# EAGLE design omc-complete (EAGLE 5.10)
GROUP: openmulticopter.org (c) 2009; LICENSE: CC-BY-SA 3.0 DE; PROJECT_NAME: openmulticopter - mini; REV: v0.1

## Sheet 1 of 6
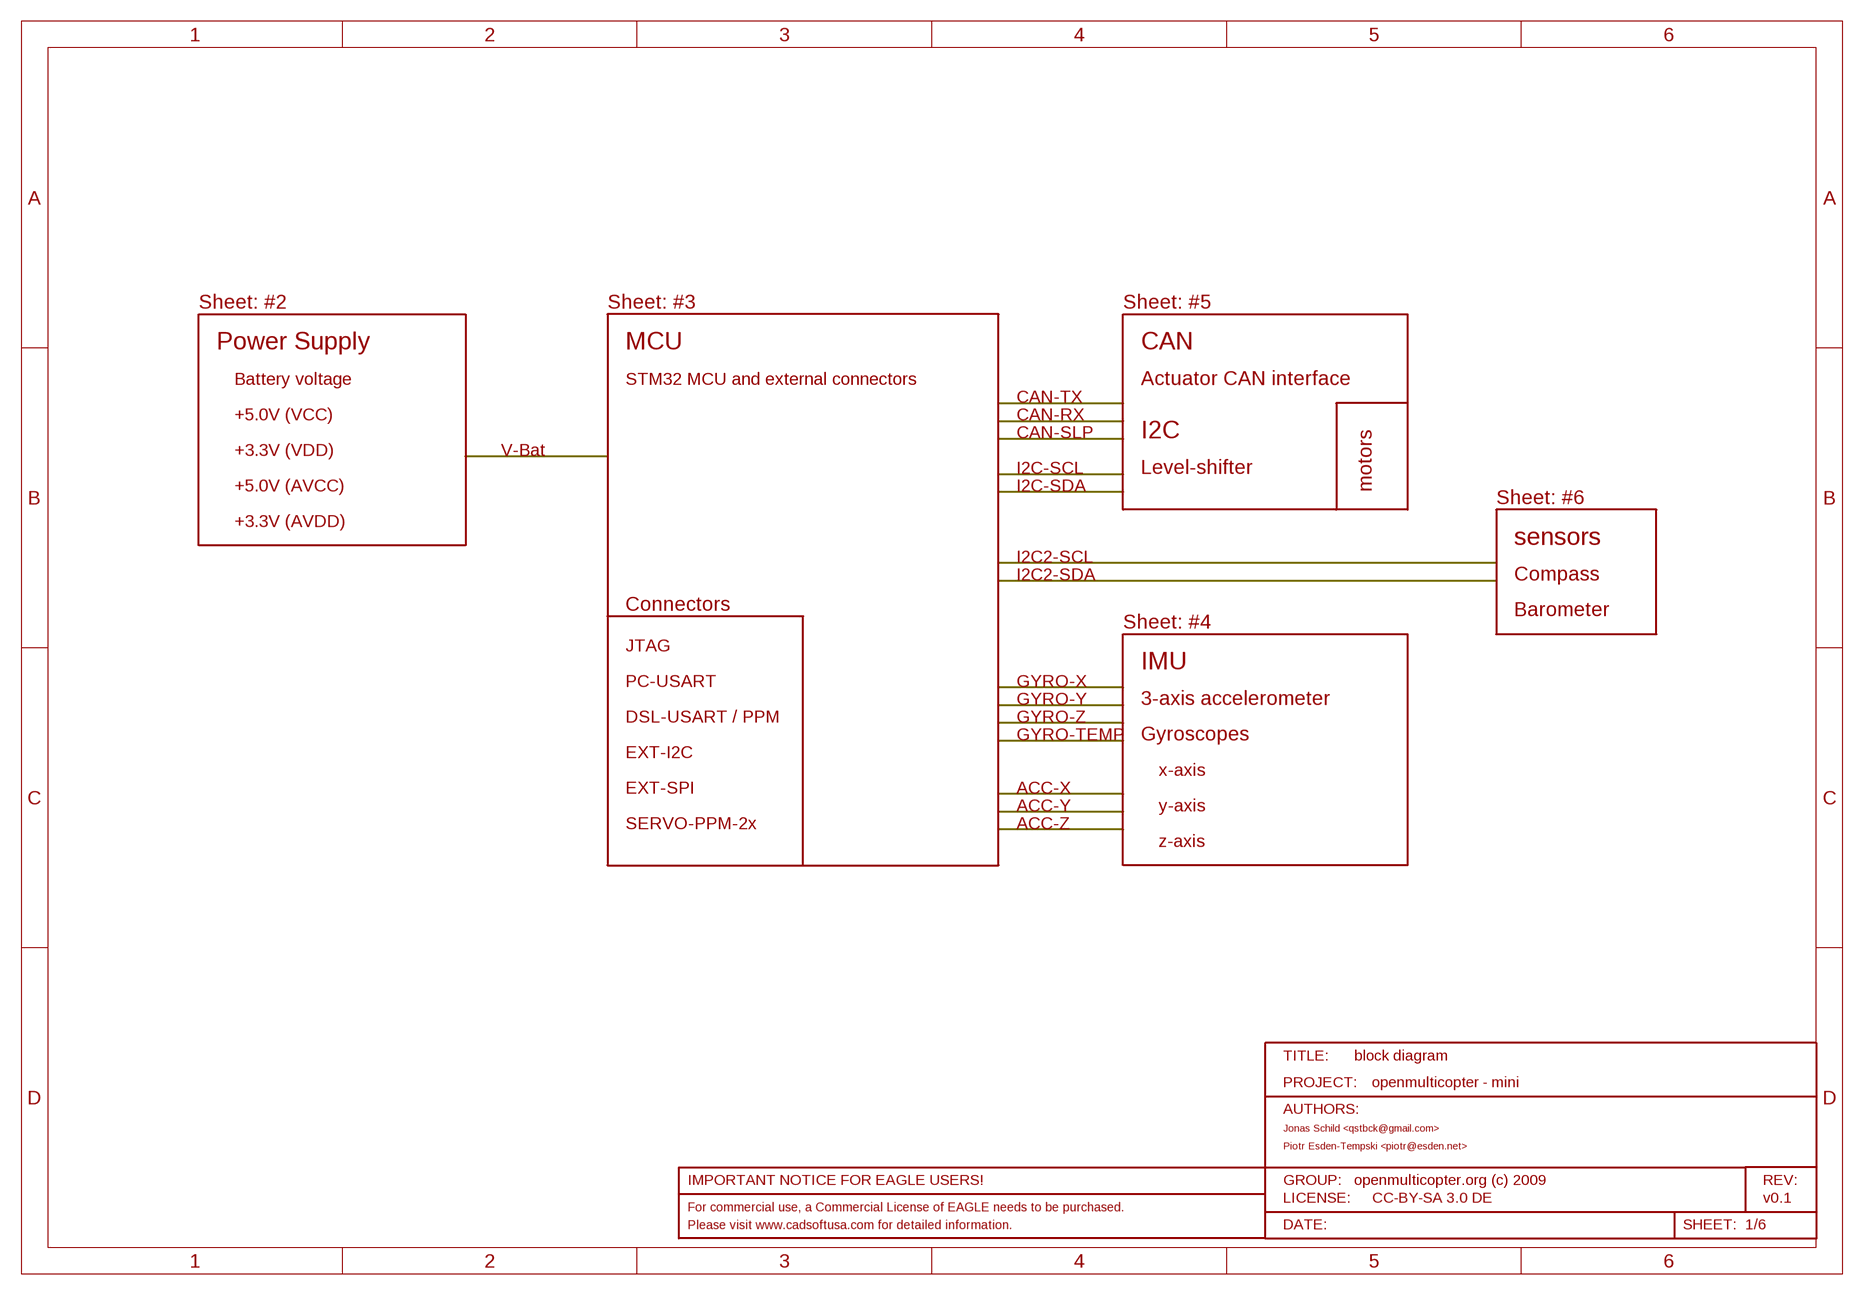
[diagram p0: schematic, sheet 1]

### Notes on the sheet
- Sheet: #2 | Sheet: #3 | Sheet: #5
- Power Supply | MCU | CAN
- Battery voltage | STM32 MCU and external connectors | Actuator CAN interface
- CAN-TX
- +5.0V (VCC) | CAN-RX
- CAN-SLP | I2C
- +3.3V (VDD) | V-Bat
- I2C-SCL | Level-shifter
- +5.0V (AVCC) | I2C-SDA | motors
- Sheet: #6
- +3.3V (AVDD)
- sensors
- I2C2-SCL
- I2C2-SDA | Compass
- Connectors | Barometer
- Sheet: #4
- JTAG
- IMU
- PC-USART | GYRO-X
- GYRO-Y | 3-axis accelerometer
- DSL-USART / PPM | GYRO-Z
- GYRO-TEMP | Gyroscopes
- EXT-I2C
- x-axis
- EXT-SPI | ACC-X
- ACC-Y | y-axis
- SERVO-PPM-2x | ACC-Z
- z-axis
- block diagram
- Jonas Schild <qstbck@gmail.com>
- Piotr Esden-Tempski <piotr@esden.net>

## Sheet 2 of 6
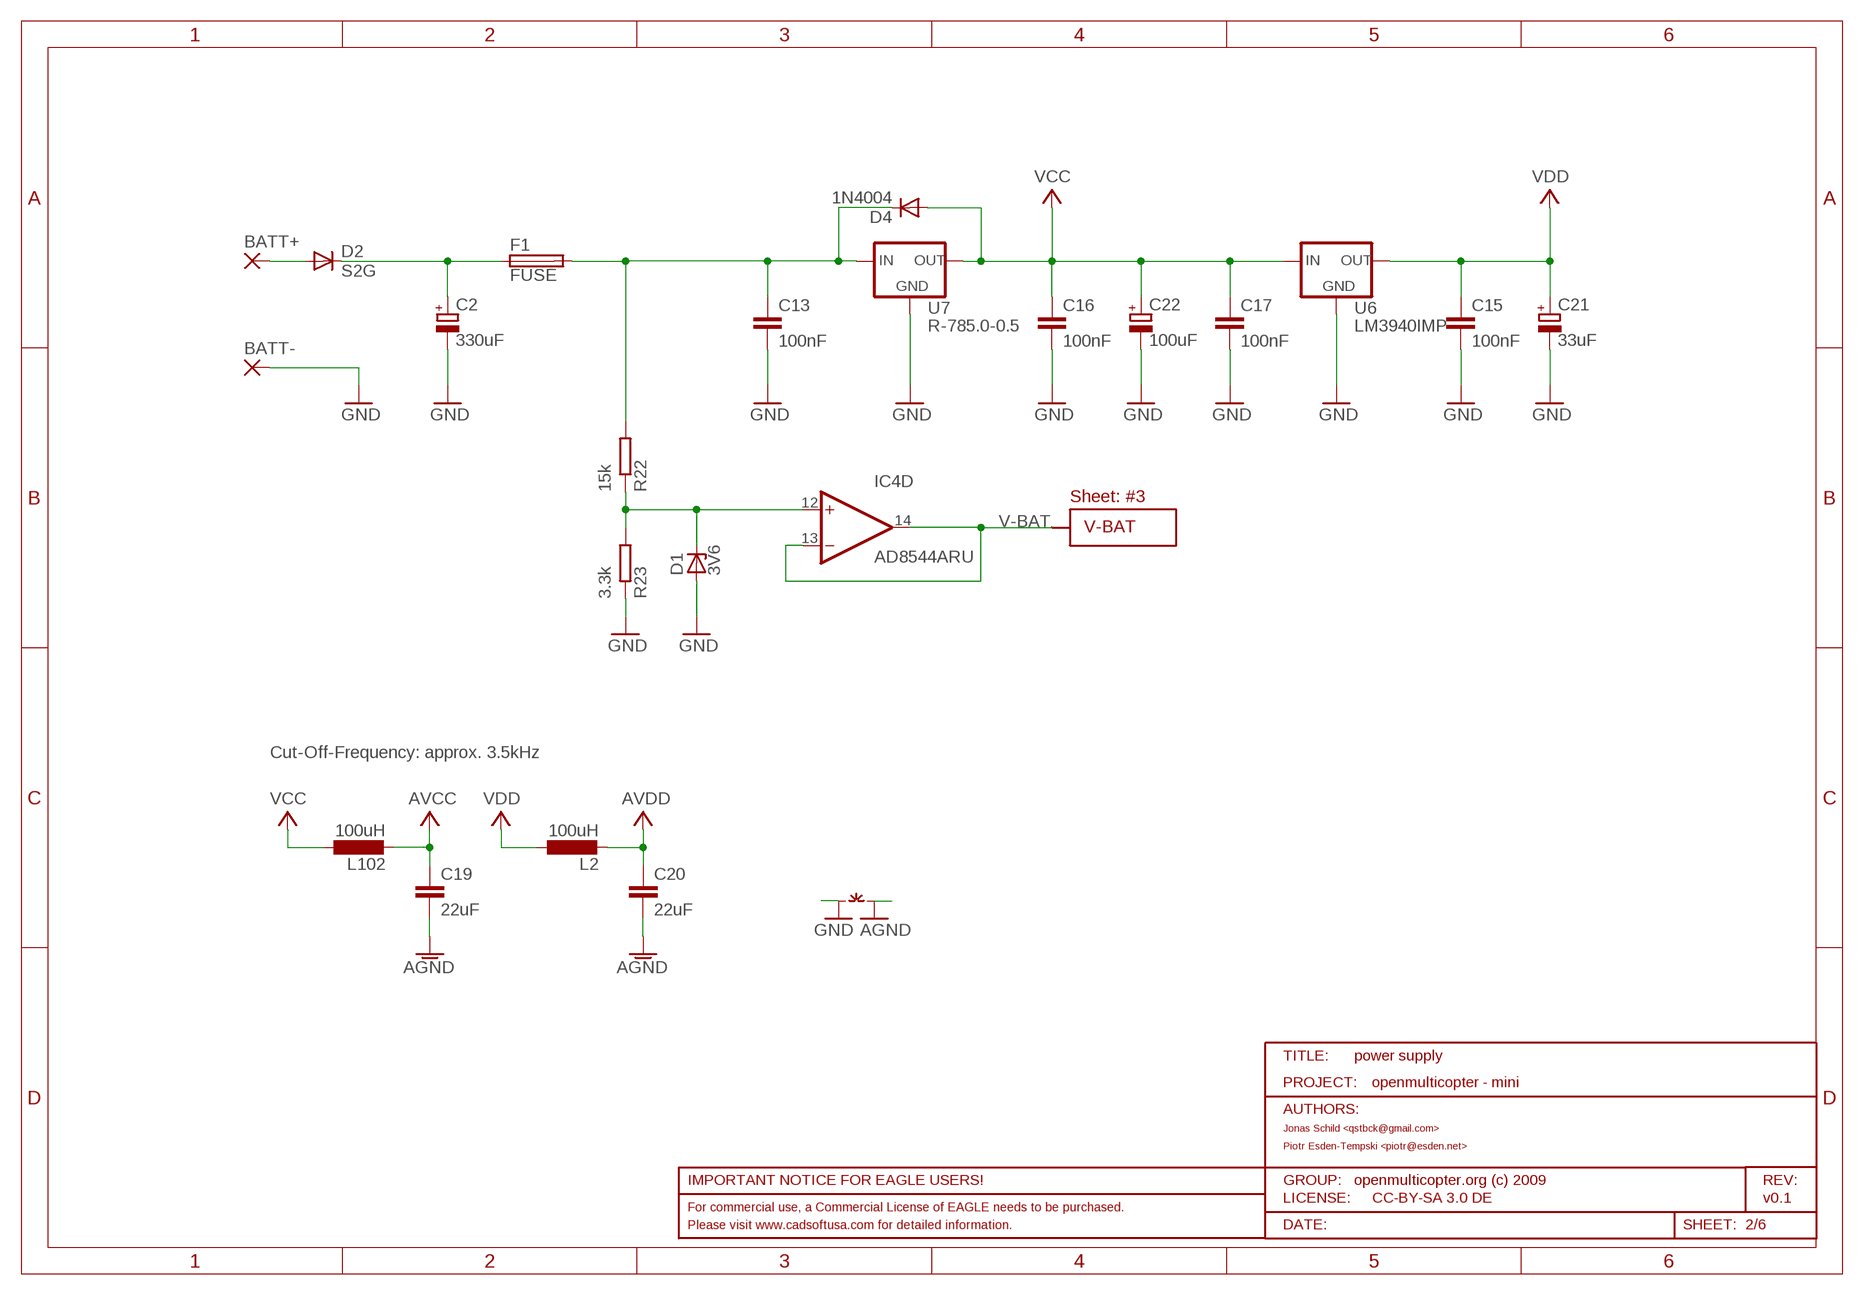
[diagram p1: schematic, sheet 2]

### Parts
BATT+  3,17/1,1  [3,17/1,1]
BATT-  3,17/1,1  [3,17/1,1]
C2  330uF  CPOL-EUE3.5-8  [E3,5-8]
C13  100nF  CAPACITOR-0603  [0603-CAP]
C15  100nF  CAPACITOR-0603  [0603-CAP]
C16  100nF  CAPACITOR-0603  [0603-CAP]
C17  100nF  CAPACITOR-0603  [0603-CAP]
C19  22uF  CAPACITOR-0805  [0805-CAP]
C20  22uF  CAPACITOR-0805  [0805-CAP]
C21  33uF  CAPACITOR-POLB  [3528/B]
C22  100uF  CPOL-EUE2-5  [E2-5]
D1  3V6  ZENER-DIODESOT23  [SOT23]
D2  S2G  DIODE-B  [3528/B-DIO]
D4  1N4004  DIODE-MELF  [MELF-MLL41]
F1  FUSE  FUSE-1206  [1206-FUSE]
IC4  AD8544ARU  [TSSOP14]
L2  100uH  INDUCTOR-0805  [0805-IND]
L102  100uH  INDUCTOR-1210  [1210-IND]
R22  15k  RESISTOR-0603  [0603-RES]
R23  3.3k  RESISTOR-0603  [0603-RES]
U6  LM3940IMP  [SOT223]
U7  R-785.0-0.5  R-78XX  [R-78XX]
U$2  GND-AGND  [GND-AGND]

### Nets
AGND: C19.P$2 C20.P$2 U$2.AGND ; also sheet 3,4
AVCC: C19.P$1 L102.P$2 ; also sheet 4
AVDD: C20.P$1 L2.P$2 ; also sheet 3,4
GND: BATT-.1(P) C2.- C13.P$2 C15.P$2 C16.P$2 C17.P$2 C21.- C22.- D1.1(A) R23.P$1 U6.2(GND) U7.GND U$2.GND ; also sheet 3,5,6
N$7: C13.P$1 D4.C F1.P$2 R22.P$2 U7.IN
N$8: BATT+.1(P) D2.A
N$21: C2.+ D2.C F1.P$1
N$30: D1.3(C) IC4.12(D:+IN) R22.P$1 R23.P$2
V-BAT: IC4.13(D:-IN) IC4.14(D:OUT) ; also sheet 3
VCC: C16.P$1 C17.P$1 C22.+ D4.A L102.P$1 U6.1(IN) U7.OUT ; also sheet 3,5
VDD: C15.P$1 C21.+ L2.P$1 U6.3(OUT) ; also sheet 3,5,6

### Notes on the sheet
- Sheet: #3
- V-BAT
- Cut-Off-Frequency: approx. 3.5kHz
- power supply
- Jonas Schild <qstbck@gmail.com>
- Piotr Esden-Tempski <piotr@esden.net>

## Sheet 3 of 6
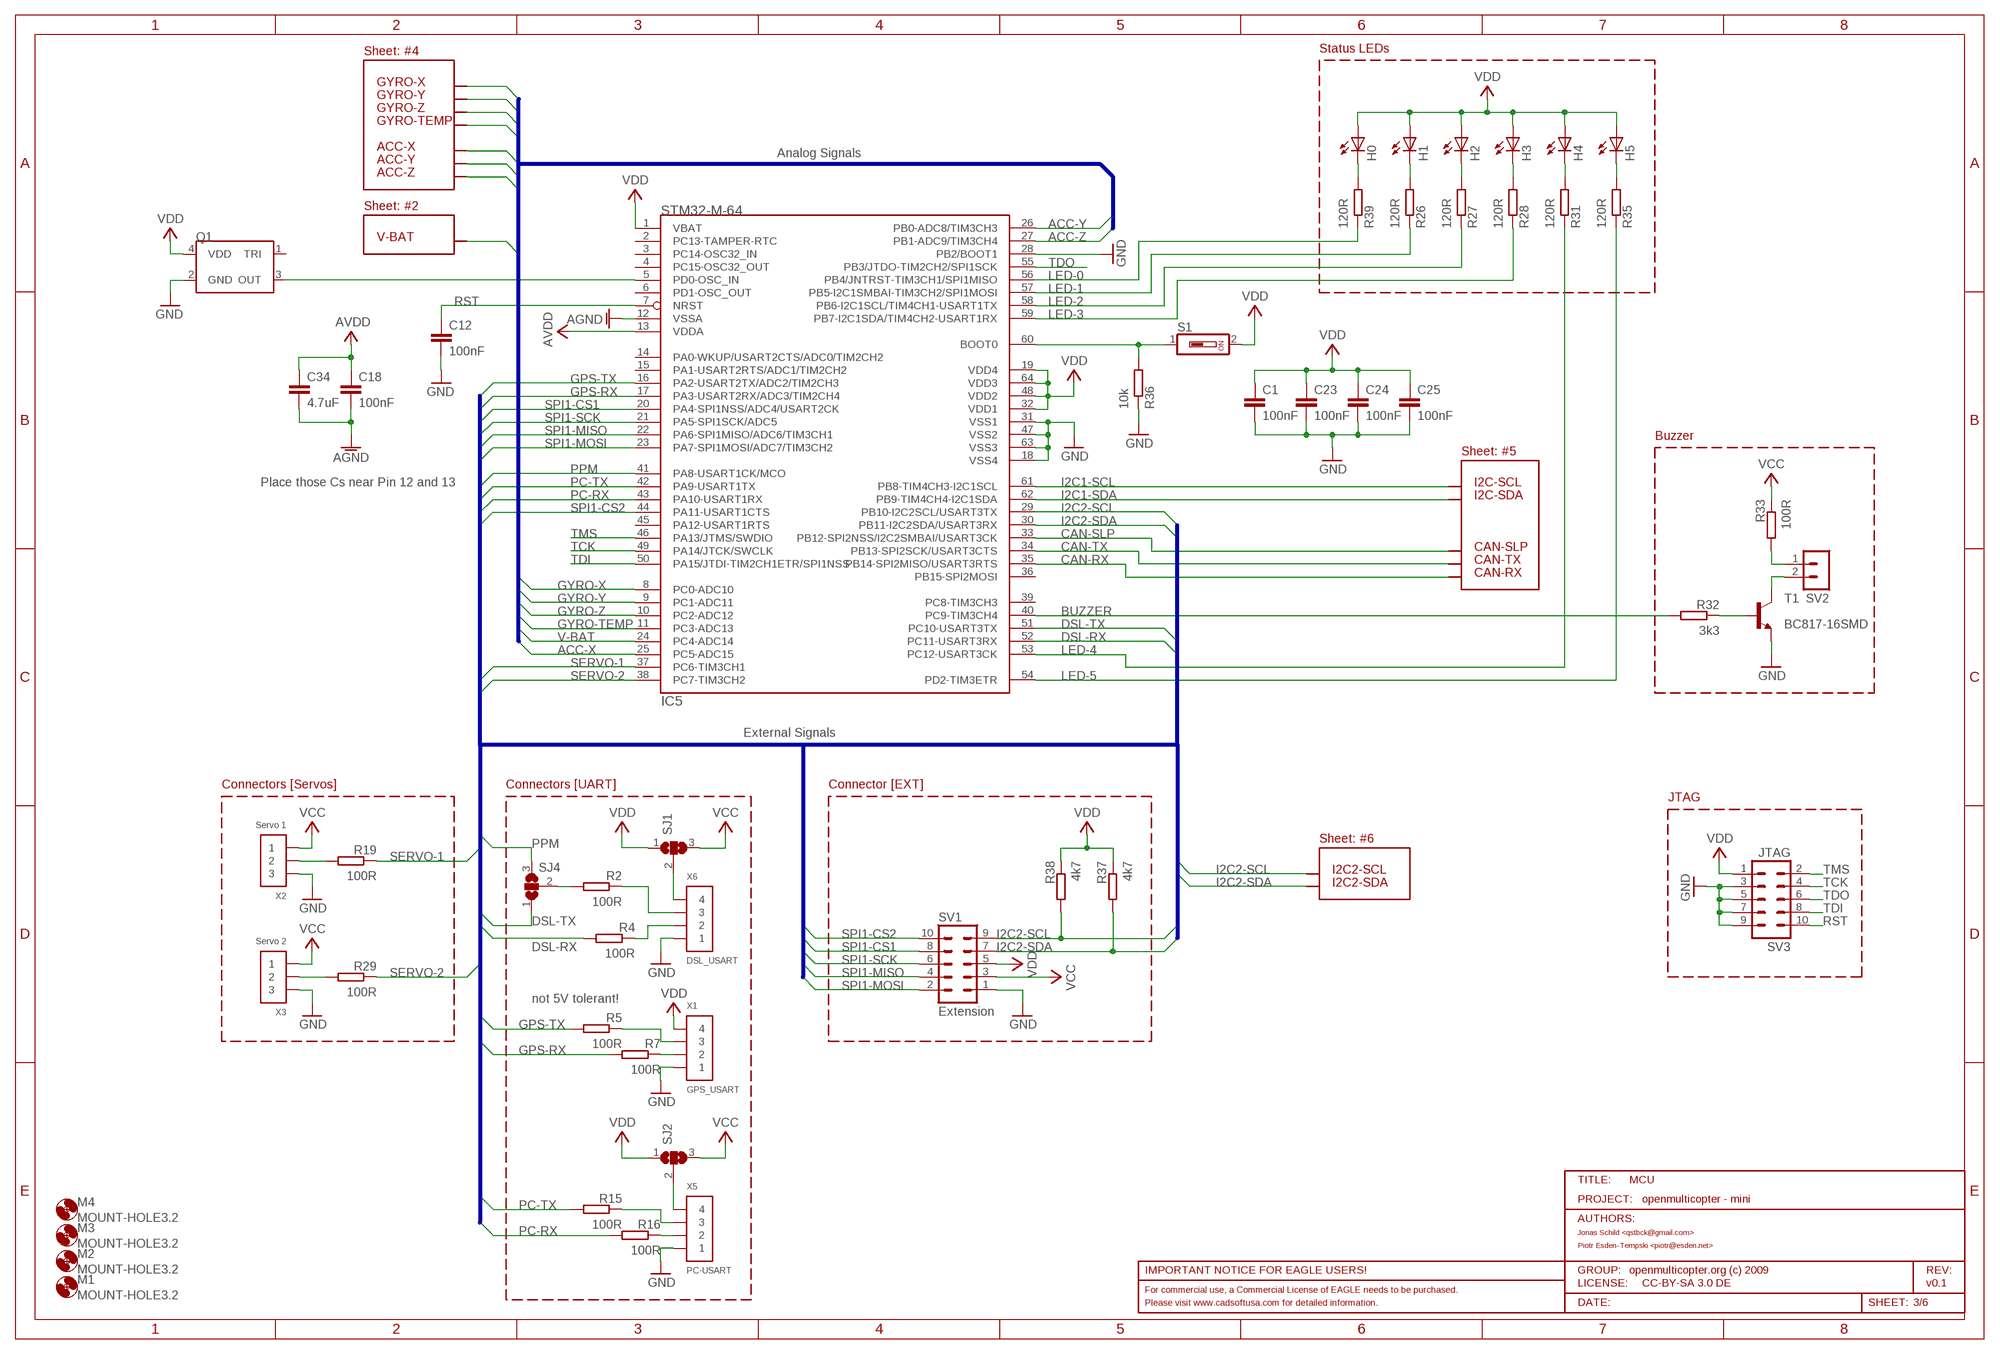
[diagram p2: schematic, sheet 3]

### Parts
C1  100nF  CAPACITOR-0603  [0603-CAP]
C12  100nF  CAPACITOR-0603  [0603-CAP]
C18  100nF  CAPACITOR-0603  [0603-CAP]
C23  100nF  CAPACITOR-0603  [0603-CAP]
C24  100nF  CAPACITOR-0603  [0603-CAP]
C25  100nF  CAPACITOR-0603  [0603-CAP]
C34  4.7uF  CAPACITOR-0603  [0603-CAP]
H0  LED-0603  [0603-LED]
H1  LED-0603  [0603-LED]
H2  LED-0603  [0603-LED]
H3  LED-0603  [0603-LED]
H4  LED-0603  [0603-LED]
H5  LED-0603  [0603-LED]
IC5  STM32-M-64  [LQFP64]
M1  MOUNT-HOLE3.2  [3,2]
M2  MOUNT-HOLE3.2  [3,2]
M3  MOUNT-HOLE3.2  [3,2]
M4  MOUNT-HOLE3.2  [3,2]
Q1  ASE_OSCILLATOR  [ASE_OSCILLATOR]
R2  100R  RESISTOR-0603  [0603-RES]
R4  100R  RESISTOR-0603  [0603-RES]
R5  100R  RESISTOR-0603  [0603-RES]
R7  100R  RESISTOR-0603  [0603-RES]
R15  100R  RESISTOR-0603  [0603-RES]
R16  100R  RESISTOR-0603  [0603-RES]
R19  100R  RESISTOR-0603  [0603-RES]
R26  120R  RESISTOR-0603  [0603-RES]
R27  120R  RESISTOR-0603  [0603-RES]
R28  120R  RESISTOR-0603  [0603-RES]
R29  100R  RESISTOR-0603  [0603-RES]
R31  120R  RESISTOR-0603  [0603-RES]
R32  3k3  RESISTOR-0603  [0603-RES]
R33  100R  RESISTOR-0603  [0603-RES]
R35  120R  RESISTOR-0603  [0603-RES]
R36  10k  RESISTOR-0603  [0603-RES]
R37  4k7  RESISTOR-0603  [0603-RES]
R38  4k7  RESISTOR-0603  [0603-RES]
R39  120R  RESISTOR-0603  [0603-RES]
S1  COPAL_CVS-01B  [COPAL_CVS-01B]
SJ1  SJ2S  [SJ2S]
SJ2  SJ2S  [SJ2S]
SJ4  SJ2S  [SJ2S]
SV1  Extension  ML10L  [ML10L]
SV2  MA02-1  [MA02-1]
SV3  JTAG  ML10  [SMD_HEADER_1.27MM_2X5]
T1  BC817-16SMD  [SOT23-BEC]
X1  GPS_USART  CONN_4-1-53261  [PB-53261-04]
X2  Servo 1  CONN_3-1-53047  [PB-53047-03]
X3  Servo 2  CONN_3-1-53047  [PB-53047-03]
X5  PC-USART  CONN_4-1-53261  [PB-53261-04]
X6  DSL_USART  CONN_4-1-53261  [PB-53261-04]

### Nets
ACC-X: IC5.25(PC5-ADC15) ; also sheet 4
ACC-Y: IC5.26(PB0-ADC8/TIM3CH3) ; also sheet 4
ACC-Z: IC5.27(PB1-ADC9/TIM3CH4) ; also sheet 4
AGND: C18.P$2 C34.P$2 IC5.12(VSSA) ; also sheet 2,4
AVDD: C18.P$1 C34.P$1 IC5.13(VDDA) ; also sheet 2,4
BUZZER: IC5.40(PC9-TIM3CH4) R32.P$2
CAN-RX: IC5.35(PB14-SPI2MISO/USART3RTS) ; also sheet 5
CAN-SLP: IC5.33(PB12-SPI2NSS/I2C2SMBAI/USART3CK) ; also sheet 5
CAN-TX: IC5.34(PB13-SPI2SCK/USART3CTS) ; also sheet 5
DSL-RX: IC5.52(PC11-USART3RX) R4.P$2
DSL-TX: IC5.51(PC10-USART3TX) SJ4.1
GND: C1.P$2 C12.P$2 C23.P$2 C24.P$2 C25.P$2 IC5.18(VSS4) IC5.28(PB2/BOOT1) IC5.31(VSS1) IC5.47(VSS2) IC5.63(VSS3) Q1.2(GND) R36.P$1 SV1.1 SV3.3 SV3.5 SV3.7 SV3.9 T1.E X1.1 X2.3 X3.3 X5.1 X6.1 ; also sheet 2,5,6
GPS-RX: IC5.17(PA3-USART2RX/ADC3/TIM2CH4) R7.P$2
GPS-TX: IC5.16(PA2-USART2TX/ADC2/TIM2CH3) R5.P$2
GYRO-TEMP: IC5.11(PC3-ADC13) ; also sheet 4
GYRO-X: IC5.8(PC0-ADC10) ; also sheet 4
GYRO-Y: IC5.9(PC1-ADC11) ; also sheet 4
GYRO-Z: IC5.10(PC2-ADC12) ; also sheet 4
H4: H4.C R31.P$2
I2C1-SCL: IC5.61(PB8-TIM4CH3-I2C1SCL) ; also sheet 5
I2C1-SDA: IC5.62(PB9-TIM4CH4-I2C1SDA) ; also sheet 5
I2C2-SCL: IC5.29(PB10-I2C2SCL/USART3TX) R38.P$2 SV1.9 ; also sheet 6
I2C2-SDA: IC5.30(PB11-I2C2SDA/USART3RX) R37.P$2 SV1.7 ; also sheet 6
LED-0: IC5.56(PB4/JNTRST-TIM3CH1/SPI1MISO) R39.P$1
LED-1: IC5.57(PB5-I2C1SMBAI-TIM3CH2/SPI1MOSI) R26.P$1
LED-2: IC5.58(PB6-I2C1SCL/TIM4CH1-USART1TX) R27.P$1
LED-3: IC5.59(PB7-I2C1SDA/TIM4CH2-USART1RX) R28.P$1
LED-4: IC5.53(PC12-USART3CK) R31.P$1
LED-5: IC5.54(PD2-TIM3ETR) R35.P$1
N$1: SJ2.2 X5.4
N$2: R4.P$1 X6.2
N$3: IC5.5(PD0-OSC_IN) Q1.3(OUT)
N$4: R7.P$1 X1.2
N$6: R2.P$1 X6.3
N$9: R16.P$1 X5.2
N$10: R5.P$1 X1.3
N$20: R15.P$1 X5.3
N$23: SJ1.2 X6.4
N$25: R33.P$2 SV2.1
N$27: R2.P$2 SJ4.2
N$28: IC5.60(BOOT0) R36.P$2 S1.1
N$29: SV2.2 T1.C
N$31: R32.P$1 T1.B
N$33: H5.C R35.P$2
N$35: H0.C R39.P$2
N$37: R19.P$2 X2.2
N$41: H1.C R26.P$2
N$44: H2.C R27.P$2
N$45: H3.C R28.P$2
N$46: R29.P$2 X3.2
PC-RX: IC5.43(PA10-USART1RX) R16.P$2
PC-TX: IC5.42(PA9-USART1TX) R15.P$2
PPM: IC5.41(PA8-USART1CK/MCO) SJ4.3
RST: C12.P$1 IC5.7(NRST) SV3.10
SERVO-1: IC5.37(PC6-TIM3CH1) R19.P$1
SERVO-2: IC5.38(PC7-TIM3CH2) R29.P$1
SPI1-CS1: IC5.20(PA4-SPI1NSS/ADC4/USART2CK) SV1.8
SPI1-CS2: IC5.44(PA11-USART1CTS) SV1.10
SPI1-MISO: IC5.22(PA6-SPI1MISO/ADC6/TIM3CH1) SV1.4
SPI1-MOSI: IC5.23(PA7-SPI1MOSI/ADC7/TIM3CH2) SV1.2
SPI1-SCK: IC5.21(PA5-SPI1SCK/ADC5) SV1.6
TCK: IC5.49(PA14/JTCK/SWCLK) SV3.4
TDI: IC5.50(PA15/JTDI-TIM2CH1ETR/SPI1NSS) SV3.8
TDO: IC5.55(PB3/JTDO-TIM2CH2/SPI1SCK) SV3.6
TMS: IC5.46(PA13/JTMS/SWDIO) SV3.2
V-BAT: IC5.24(PC4-ADC14) ; also sheet 2
VCC: R33.P$1 SJ1.3 SJ2.3 SV1.3 X2.1 X3.1 ; also sheet 2,5
VDD: C1.P$1 C23.P$1 C24.P$1 C25.P$1 H0.A H1.A H2.A H3.A H4.A H5.A IC5.1(VBAT) IC5.19(VDD4) IC5.32(VDD1) IC5.48(VDD2) IC5.64(VDD3) Q1.4(VDD) R37.P$1 R38.P$1 S1.2 SJ1.1 SJ2.1 SV1.5 SV3.1 X1.4 ; also sheet 2,5,6
Unconnected: IC5.2(PC13-TAMPER-RTC) IC5.3(PC14-OSC32_IN) IC5.4(PC15-OSC32_OUT) IC5.6(PD1-OSC_OUT) IC5.14(PA0-WKUP/USART2CTS/ADC0/TIM2CH2) IC5.15(PA1-USART2RTS/ADC1/TIM2CH2) IC5.36(PB15-SPI2MOSI) IC5.39(PC8-TIM3CH3) IC5.45(PA12-USART1RTS) Q1.1(TRI)

### Buses
CON:GPS-TX,GPS-RX,SPI1-SCK,SPI1-MISO,SPI1-MOSI,SPI1-CS[1..2],PC-TX,PC-RX,SERVO-[1..2],I2C2-SCL,I2C2-SDA,DSL-TX,DSL-RX,PPM
SENSOR:ACC-X,ACC-Y,ACC-Z,GYRO-X,GYRO-Y,GYRO-Z,GYRO-TEMP,V-BAT

### Notes on the sheet
- Sheet: #4 | Status LEDs
- GYRO-X
- GYRO-Y
- GYRO-Z
- GYRO-TEMP
- ACC-X
- Analog Signals
- ACC-Y
- ACC-Z
- Sheet: #2
- V-BAT
- Buzzer
- Sheet: #5
- Place those Cs near Pin 12 and 13 | I2C-SCL
- I2C-SDA
- CAN-SLP
- CAN-TX
- CAN-RX
- External Signals
- Connectors [Servos] | Connectors [UART] | Connector [EXT]
- JTAG
- Sheet: #6
- I2C2-SCL
- I2C2-SDA
- not 5V tolerant!
- MCU
- Jonas Schild <qstbck@gmail.com>
- Piotr Esden-Tempski <piotr@esden.net>

## Sheet 4 of 6
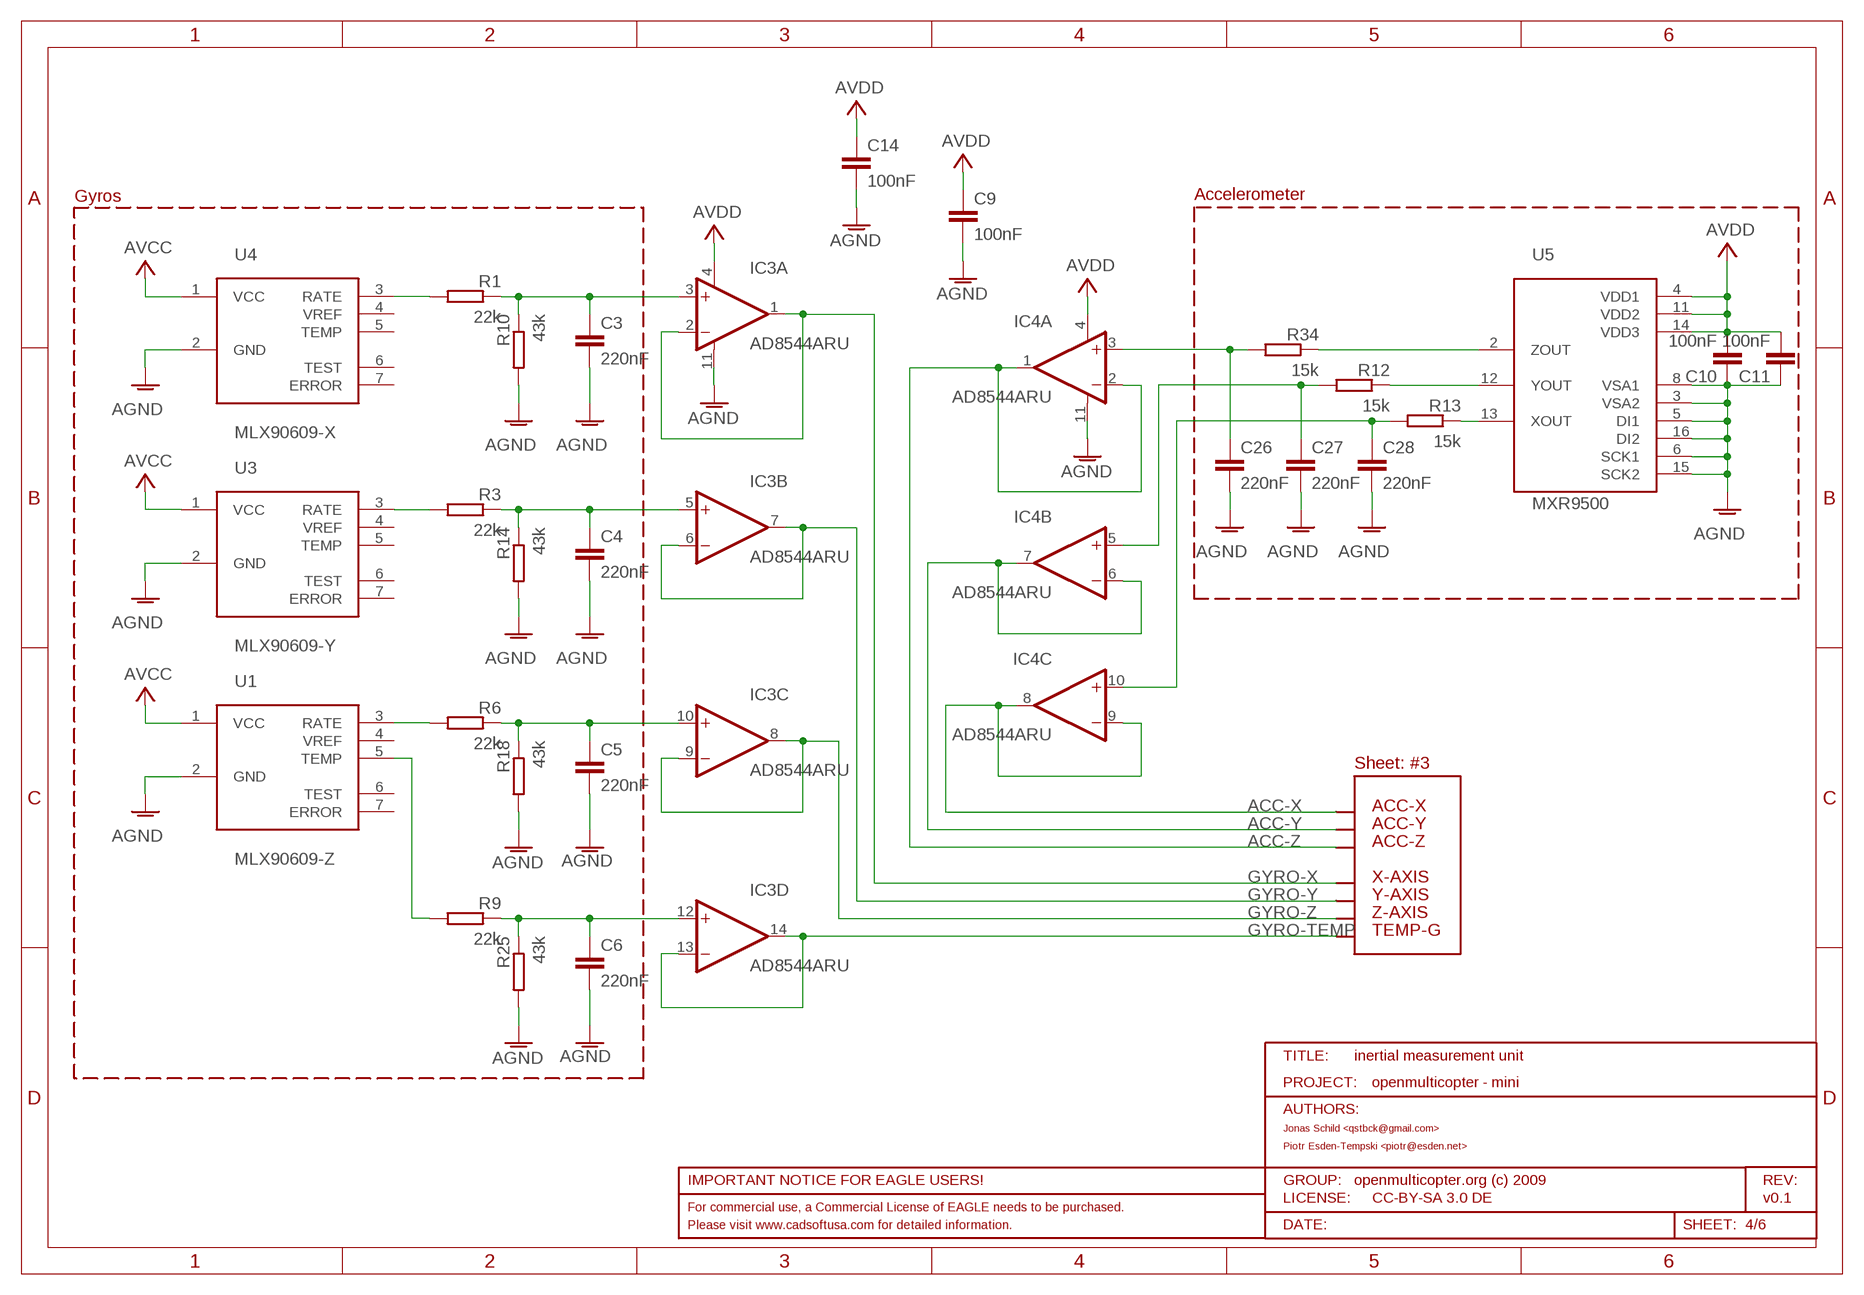
[diagram p3: schematic, sheet 4]

### Parts
C3  220nF  CAPACITOR-0603  [0603-CAP]
C4  220nF  CAPACITOR-0603  [0603-CAP]
C5  220nF  CAPACITOR-0603  [0603-CAP]
C6  220nF  CAPACITOR-0603  [0603-CAP]
C9  100nF  CAPACITOR-0603  [0603-CAP]
C10  100nF  CAPACITOR-0603  [0603-CAP]
C11  100nF  CAPACITOR-0603  [0603-CAP]
C14  100nF  CAPACITOR-0603  [0603-CAP]
C26  220nF  CAPACITOR-0603  [0603-CAP]
C27  220nF  CAPACITOR-0603  [0603-CAP]
C28  220nF  CAPACITOR-0603  [0603-CAP]
IC3  AD8544ARU  [TSSOP14]
R1  22k  RESISTOR-0603  [0603-RES]
R3  22k  RESISTOR-0603  [0603-RES]
R6  22k  RESISTOR-0603  [0603-RES]
R9  22k  RESISTOR-0603  [0603-RES]
R10  43k  RESISTOR-0603  [0603-RES]
R12  15k  RESISTOR-0603  [0603-RES]
R13  15k  RESISTOR-0603  [0603-RES]
R14  43k  RESISTOR-0603  [0603-RES]
R18  43k  RESISTOR-0603  [0603-RES]
R25  43k  RESISTOR-0603  [0603-RES]
R34  15k  RESISTOR-0603  [0603-RES]
U1  MLX90609-Z  MLX90609-BREAKOUT  [MLX90609-BREAKOUT]
U3  MLX90609-Y  MLX90609-BREAKOUT  [MLX90609-BREAKOUT]
U4  MLX90609-X  MLX90609-BREAKOUT  [MLX90609-BREAKOUT]
U5  MXR9500  [MXR9500-LCC16]

### Nets
ACC-X: IC4.8(C:OUT) IC4.9(C:-IN) ; also sheet 3
ACC-Y: IC4.6(B:-IN) IC4.7(B:OUT) ; also sheet 3
ACC-Z: IC4.1(A:OUT) IC4.2(A:-IN) ; also sheet 3
AGND: C3.P$2 C4.P$2 C5.P$2 C6.P$2 C9.P$2 C10.P$1 C11.P$1 C14.P$2 C26.P$2 C27.P$2 C28.P$2 IC3.11(A:V-) IC4.11(A:V-) R10.P$2 R14.P$2 R18.P$2 R25.P$2 U1.2(GND) U3.2(GND) U4.2(GND) U5.3(VSA2) U5.5(DI1) U5.6(SCK1) U5.8(VSA1) U5.15(SCK2) U5.16(DI2) ; also sheet 2,3
AVCC: U1.1(VCC) U3.1(VCC) U4.1(VCC) ; also sheet 2
AVDD: C9.P$1 C10.P$2 C11.P$2 C14.P$1 IC3.4(A:V+) IC4.4(A:V+) U5.4(VDD1) U5.11(VDD2) U5.14(VDD3) ; also sheet 2,3
GYRO-TEMP: IC3.13(D:-IN) IC3.14(D:OUT) ; also sheet 3
GYRO-X: IC3.1(A:OUT) IC3.2(A:-IN) ; also sheet 3
GYRO-Y: IC3.6(B:-IN) IC3.7(B:OUT) ; also sheet 3
GYRO-Z: IC3.8(C:OUT) IC3.9(C:-IN) ; also sheet 3
N$11: C4.P$1 IC3.5(B:+IN) R3.P$1 R14.P$1
N$12: C3.P$1 IC3.3(A:+IN) R1.P$1 R10.P$1
N$13: R6.P$2 U1.3(RATE)
N$16: R9.P$2 U1.5(TEMP)
N$17: C5.P$1 IC3.10(C:+IN) R6.P$1 R18.P$1
N$18: C6.P$1 IC3.12(D:+IN) R9.P$1 R25.P$1
N$19: R1.P$2 U4.3(RATE)
N$22: R3.P$2 U3.3(RATE)
N$24: R34.P$1 U5.2(ZOUT)
N$26: R12.P$1 U5.12(YOUT)
N$36: R13.P$1 U5.13(XOUT)
N$40: C26.P$1 IC4.3(A:+IN) R34.P$2
N$42: C27.P$1 IC4.5(B:+IN) R12.P$2
N$43: C28.P$1 IC4.10(C:+IN) R13.P$2
Unconnected: U1.4(VREF) U1.6(TEST) U1.7(ERROR) U3.4(VREF) U3.5(TEMP) U3.6(TEST) U3.7(ERROR) U4.4(VREF) U4.5(TEMP) U4.6(TEST) U4.7(ERROR)

### Notes on the sheet
- Gyros | Accelerometer
- Sheet: #3
- ACC-X
- ACC-Y
- ACC-Z
- X-AXIS
- Y-AXIS
- Z-AXIS
- TEMP-G
- inertial measurement unit
- Jonas Schild <qstbck@gmail.com>
- Piotr Esden-Tempski <piotr@esden.net>

## Sheet 5 of 6
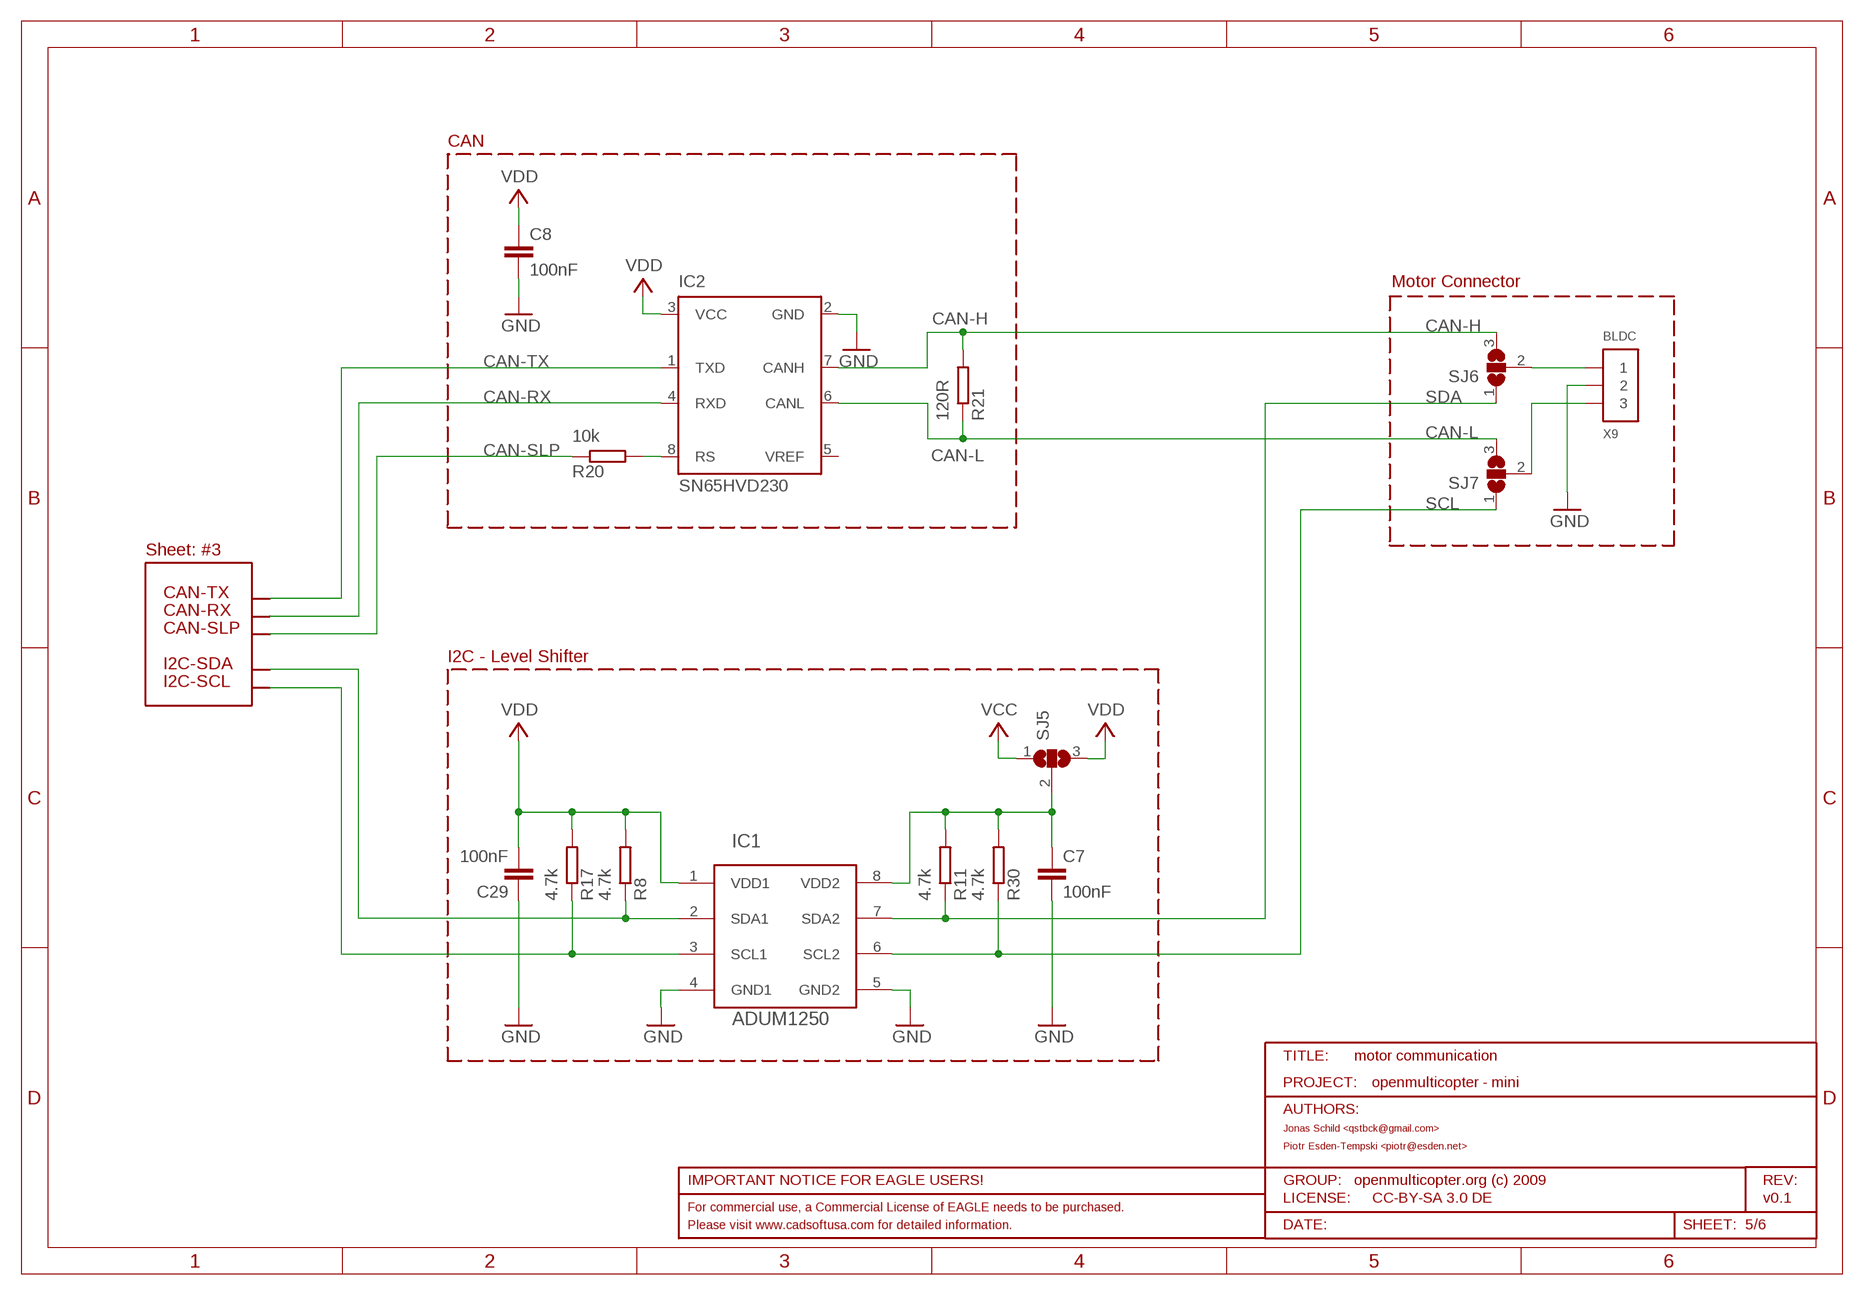
[diagram p4: schematic, sheet 5]

### Parts
C7  100nF  CAPACITOR-0603  [0603-CAP]
C8  100nF  CAPACITOR-0603  [0603-CAP]
C29  100nF  CAPACITOR-0603  [0603-CAP]
IC1  ADUM1250  [SO8]
IC2  SN65HVD230  [SO8]
R8  4.7k  RESISTOR-0603  [0603-RES]
R11  4.7k  RESISTOR-0603  [0603-RES]
R17  4.7k  RESISTOR-0603  [0603-RES]
R20  10k  RESISTOR-0603  [0603-RES]
R21  120R  RESISTOR-0603  [0603-RES]
R30  4.7k  RESISTOR-0603  [0603-RES]
SJ5  SJ2S  [SJ2S]
SJ6  SJ2S  [SJ2S]
SJ7  SJ2S  [SJ2S]
X9  BLDC  CONN_3-1-53261  [PB-53261-03]

### Nets
CAN-H: IC2.7(CANH) R21.P$2 SJ6.3
CAN-L: IC2.6(CANL) R21.P$1 SJ7.3
CAN-RX: IC2.4(RXD) ; also sheet 3
CAN-SLP: R20.P$1 ; also sheet 3
CAN-TX: IC2.1(TXD) ; also sheet 3
GND: C7.P$2 C8.P$2 C29.P$1 IC1.4(GND1) IC1.5(GND2) IC2.2(GND) X9.2 ; also sheet 2,3,6
I2C1-SCL: IC1.3(SCL1) R17.P$1 ; also sheet 3
I2C1-SDA: IC1.2(SDA1) R8.P$1 ; also sheet 3
N$5: IC2.8(RS) R20.P$2
N$14: SJ6.2 X9.1
N$15: SJ7.2 X9.3
N$38: C7.P$1 IC1.8(VDD2) R11.P$2 R30.P$2 SJ5.2
SCL: IC1.6(SCL2) R30.P$1 SJ7.1
SDA: IC1.7(SDA2) R11.P$1 SJ6.1
VCC: SJ5.1 ; also sheet 2,3
VDD: C8.P$1 C29.P$2 IC1.1(VDD1) IC2.3(VCC) R8.P$2 R17.P$2 SJ5.3 ; also sheet 2,3,6
Unconnected: IC2.5(VREF)

### Notes on the sheet
- CAN
- Motor Connector
- Sheet: #3
- CAN-TX
- CAN-RX
- CAN-SLP
- I2C - Level Shifter
- I2C-SDA
- I2C-SCL
- motor communication
- Jonas Schild <qstbck@gmail.com>
- Piotr Esden-Tempski <piotr@esden.net>

## Sheet 6 of 6
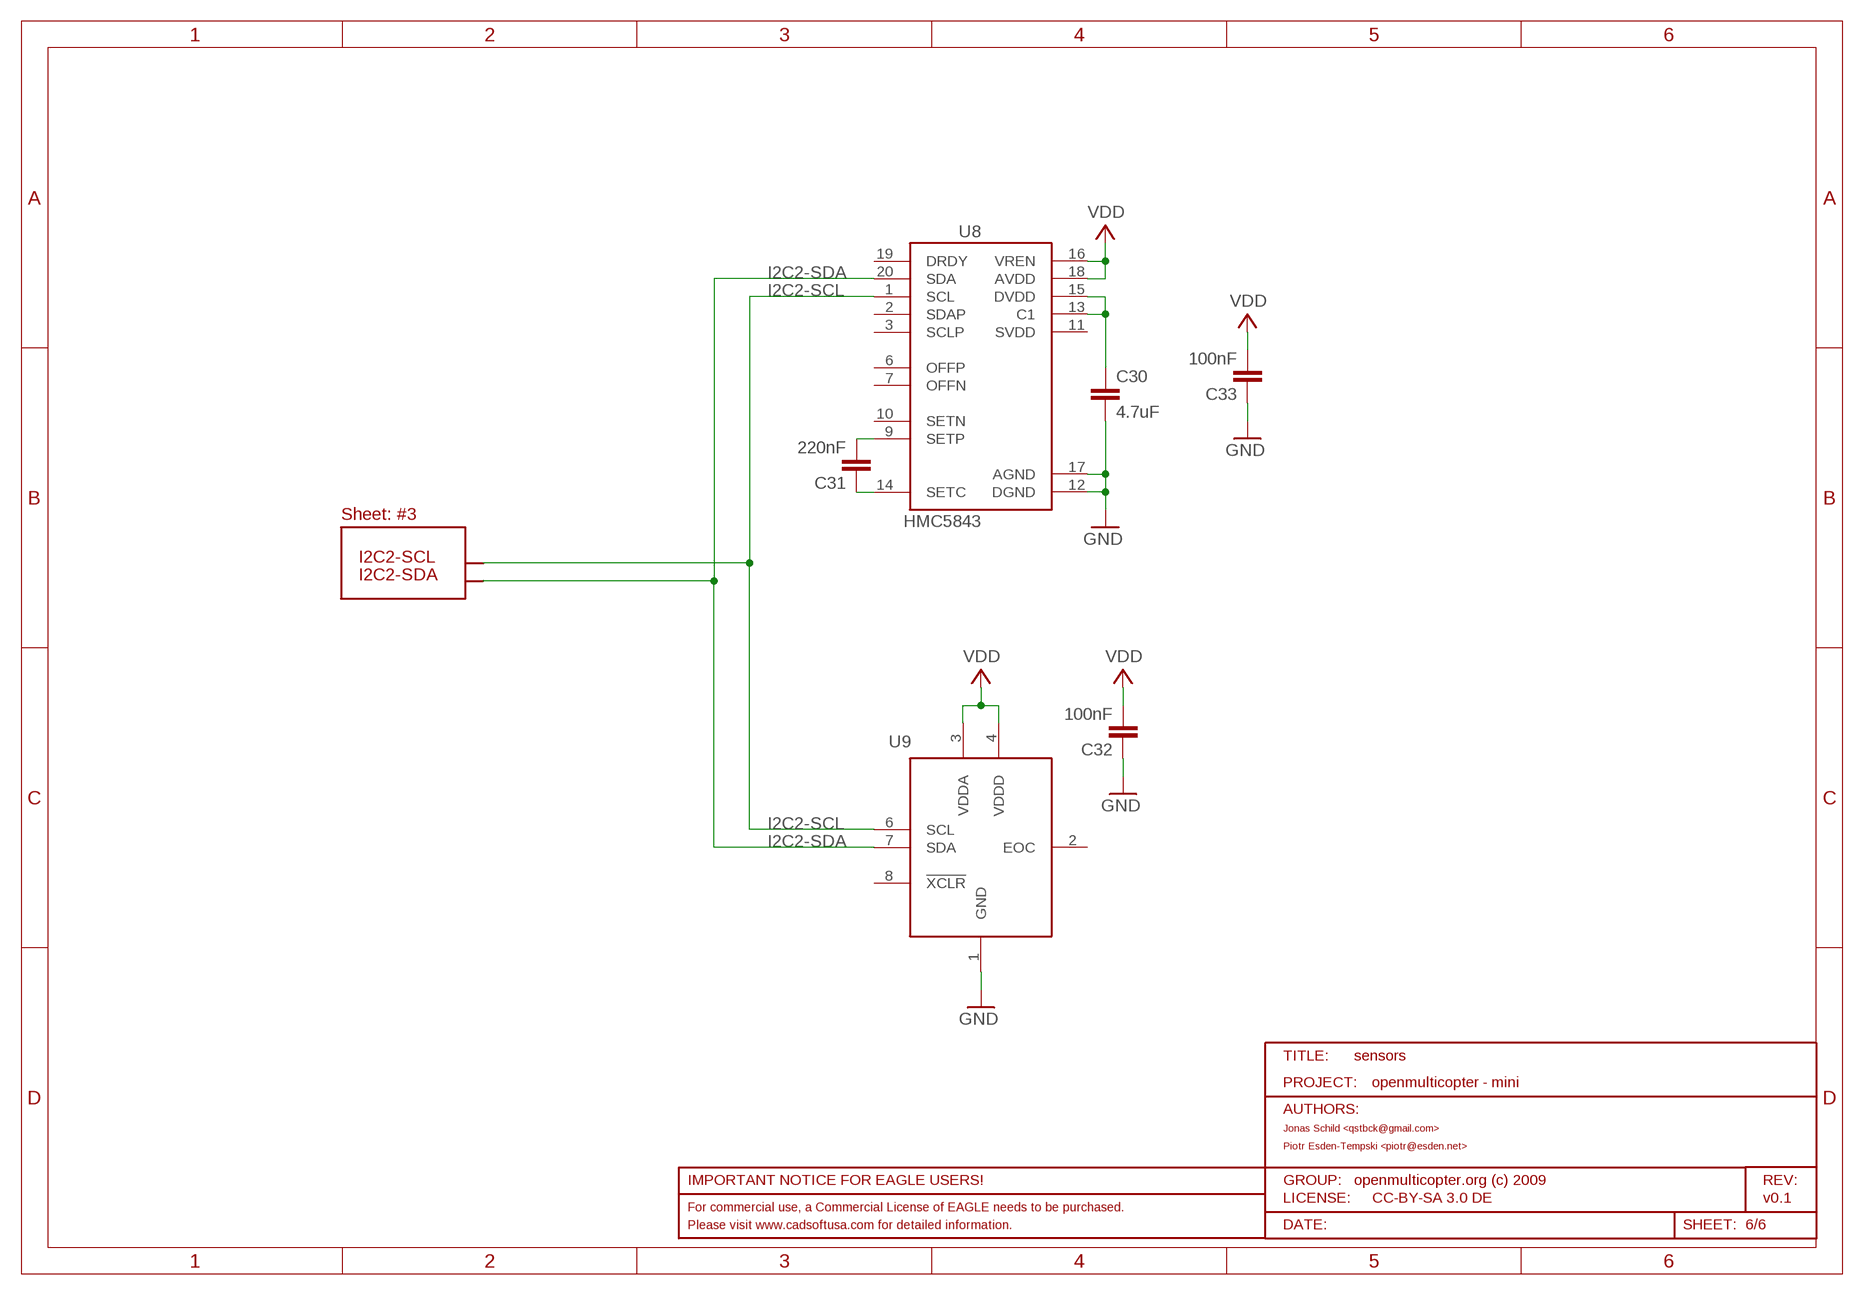
[diagram p5: schematic, sheet 6]

### Parts
C30  4.7uF  CAPACITOR-0603  [0603-CAP]
C31  220nF  CAPACITOR-0603  [0603-CAP]
C32  100nF  CAPACITOR-0603  [0603-CAP]
C33  100nF  CAPACITOR-0603  [0603-CAP]
U8  HMC5843  [LPCC20-HMC5843]
U9  BMP085  [LCC8]

### Nets
GND: C30.P$2 C32.P$1 C33.P$1 U8.12(DGND) U8.17(AGND) U9.1(GND) ; also sheet 2,3,5
I2C2-SCL: U8.1(SCL) U9.6(SCL) ; also sheet 3
I2C2-SDA: U8.20(SDA) U9.7(SDA) ; also sheet 3
N$34: C31.P$2 U8.9(SETP)
N$39: C30.P$1 U8.13(C1) U8.15(DVDD)
N$48: C31.P$1 U8.14(SETC)
VDD: C32.P$2 C33.P$2 U8.16(VREN) U8.18(AVDD) U9.3(VDDA) U9.4(VDDD) ; also sheet 2,3,5
Unconnected: U8.2(SDAP) U8.3(SCLP) U8.6(OFFP) U8.7(OFFN) U8.10(SETN) U8.11(SVDD) U8.19(DRDY) U9.2(EOC) U9.8(!XCLR)

### Notes on the sheet
- Sheet: #3
- I2C2-SCL
- I2C2-SDA
- sensors
- Jonas Schild <qstbck@gmail.com>
- Piotr Esden-Tempski <piotr@esden.net>

## Library data of the parts
BATT+ BATT- = wirepad:3,17/1,1: THROUGH-HOLE PAD
C1 C3-C20 C23-C34 = pel_dipol_comp:CAPACITOR
C2 C22 = rcl:CPOL-EU: POLARIZED CAPACITOR, European symbol
C21 = pel_dipol_comp:CAPACITOR-POL
D1 = diode:ZENER-DIODE: Z-Diode
D2 D4 = pel_dipol_comp:DIODE
F1 = pel_dipol_comp:FUSE
H0 H1-H5 = pel_dipol_comp:LED
IC1 = omc:ADUM1250: ADUM1250 - Hot Swappable, Dual I2C Isolators - Bidirectional I2C communication - Open-drain interfaces - 3.0 V to 5.5 V supply/logic levels
IC2 = omc:SN65HVD230: SN65HVD230 - 3.3V CAN Transceiver - 3.3V operation - ISO 11898 compliant - up to 1Mbps - up to 120 nodes - listen only mode - slope control
IC3 IC4 = omc:AD8544: AD8544 - General Purpose CMOS Quad Rail-to-Rail Amplifier - 2.7V to 5.5V single supply - rail-to-rail input and output - 1MHz bandwidth - unity gain stable - Low input currents: 4 pA - no phase reversal
IC5 = pel_stm32:STM32-M-64: STM32F103 Medium Density 64pin LQFP
L2 L102 = pel_dipol_comp:INDUCTOR
M1-M4 = holes:MOUNT-HOLE: MOUNTING HOLE with drill center marker
Q1 = omc:ASE_OSCILLATOR: Abracon ASE - 3.3V CMOS Crystal Clock Oscillator - 3.3V supply voltage - 0.625 MHz - 200MHz - compact and low height SMD package. http://www.abracon.com/Oscillators/ASEseries.pdf
R1-R23 R25-R39 = pel_dipol_comp:RESISTOR
S1 = omc:COPAL_CVS-01B: Copal CVS series - single dip switch - 1mm fine pitch
SJ1 SJ2 SJ4-SJ7 = omc:SJ2S: SMD jumper - 3 terminals
SV1 = con-harting-ml:ML10: HARTING
SV2 = omc:MA02-1: Pin header - 2 leads
SV3 = omc:ML10: Digikey: S9012E-05-ND
T1 = transistor-npn:BC817*: NPN Transistor
U1 U3 U4 = omc:MLX90609-BREAKOUT: MLX90609 Breakout Board
U5 = omc:MXR9500: Memsic MXR9500 - Tri Axis Accelerometer - 2.7V to 3.6V single supply - supply ratiometric operation - +/- 1.5g full-scale range - 500mV/g sensitivity @3.0V - based on heat convection, no solid proof mass - 50,000 g shock survival rating
U6 = omc:LM3940: National LM3940 - Linear Regulator - optimized for 5V to 3.3V conversion - up to 1A output current
U7 = omc:R-78XX: Recom R78xx - Switching Regulator - pin-out compatible with LM78xx - up to 97% efficiency - input range 4.75V to 18V for 1A or 34V for 0.5A version, resp. - L * W * H = 11.5mm * 7.5mm * 10.2mm - low ripple and noise (less than 30mVpp) - short circuit protection, thermal shutdown
U8 = omc:HMC5843: Honeywell HMC5843 - 3-Axis Digital Magnetometer - 3-Axis Magnetoresistive Sensors and ASIC in a Single Package - Low Voltage Operations (2.5 to 3.3V) - I2C Interface
U9 = omc:BMP085: BMP085 - Digital pressure sensor - Temperature measurement included - I2C interface - Fully calibrated Datasheet <http://www.sparkfun.com/datasheets/Components/General/BST-BMP085-DS000-05.pdf>
U$2 = omc:GND-AGND: Example of GND--GNDA NET-Connetor for more info see description in package
X1 X5 X6 = pel_molex:CONN_4-1
X2 X3 X9 = pel_molex:CONN_3-1

## Net classes
0 default: width 0.152 mm, drill 0.305 mm, clearance 0.152 mm
1 VCC: width 0.61 mm, drill 0.4 mm, clearance 0.203 mm

## Board
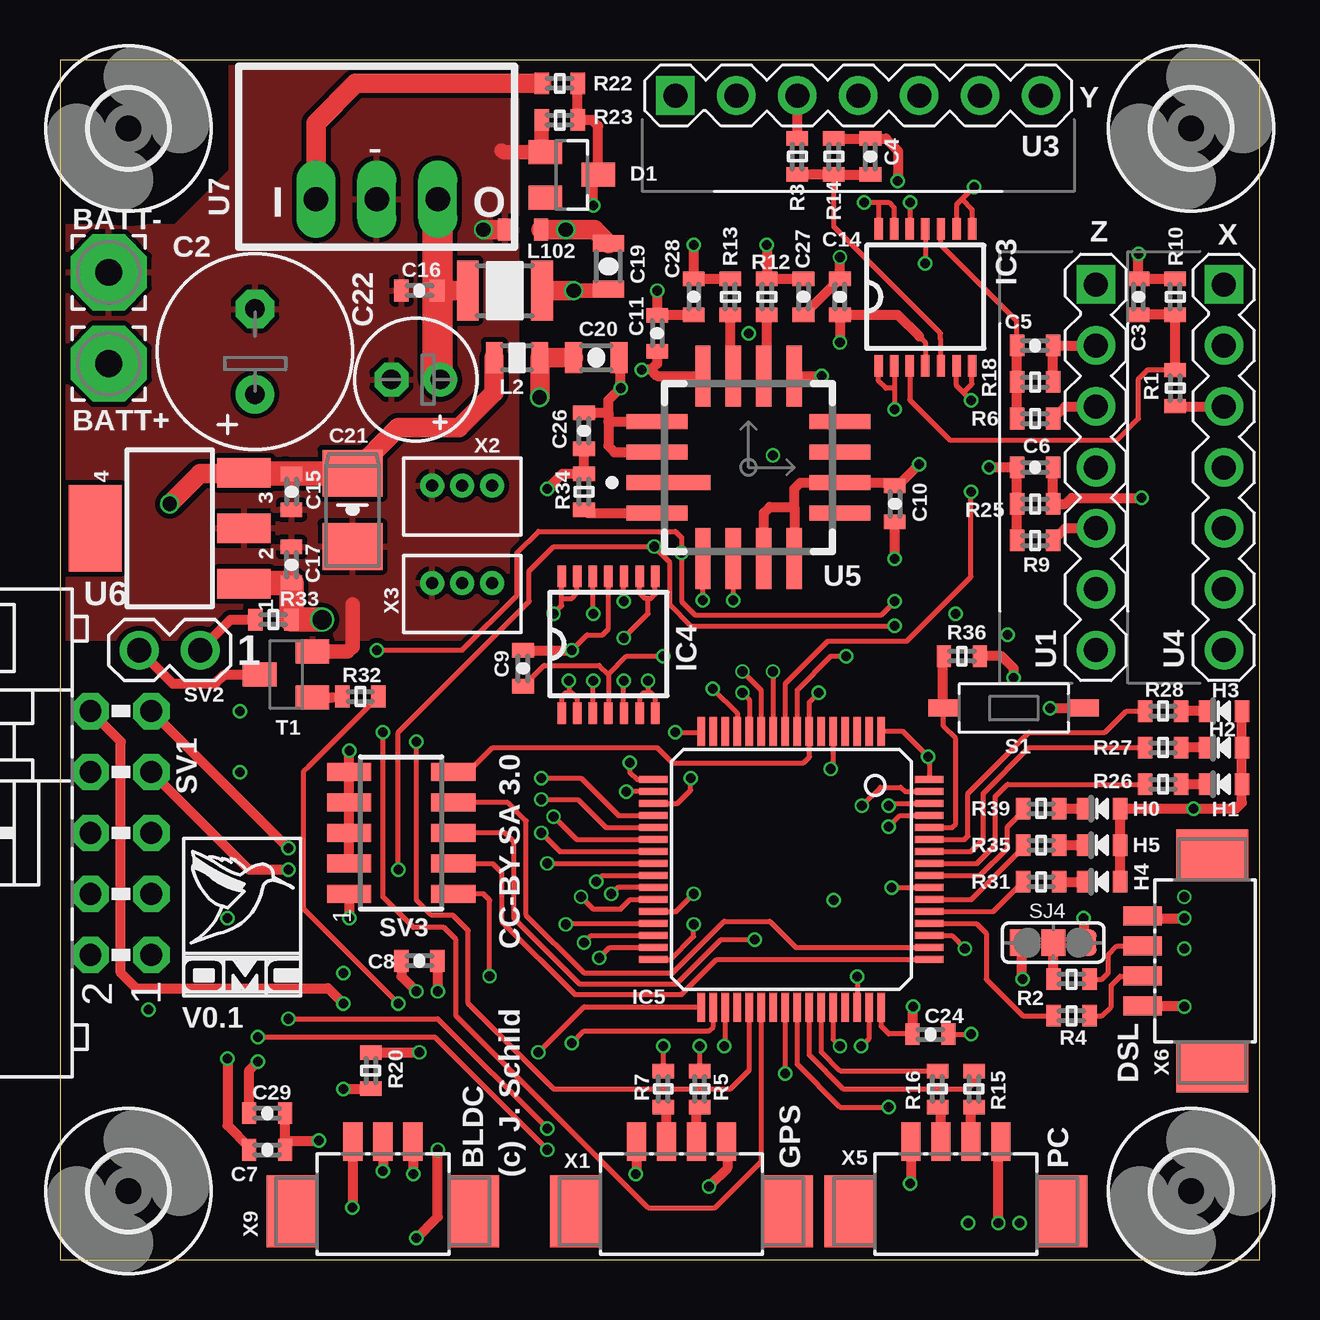
[diagram p6: board, top side]
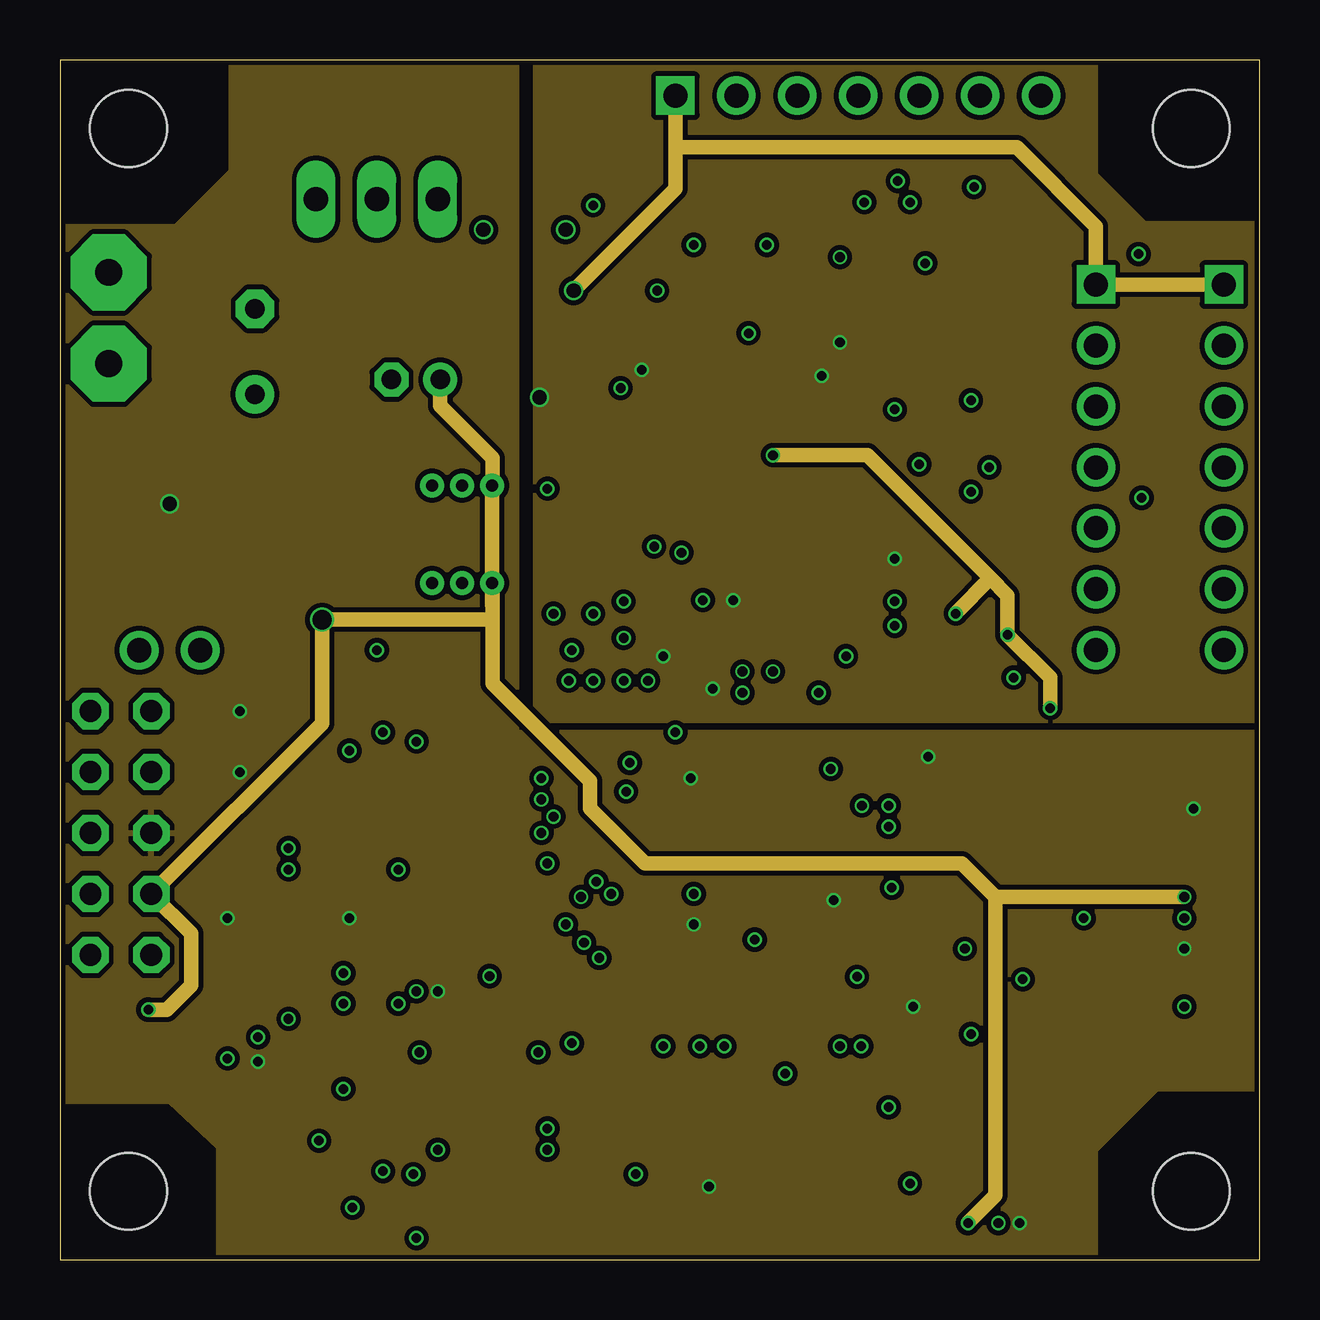
[diagram p7: board, inner layer Layer2]
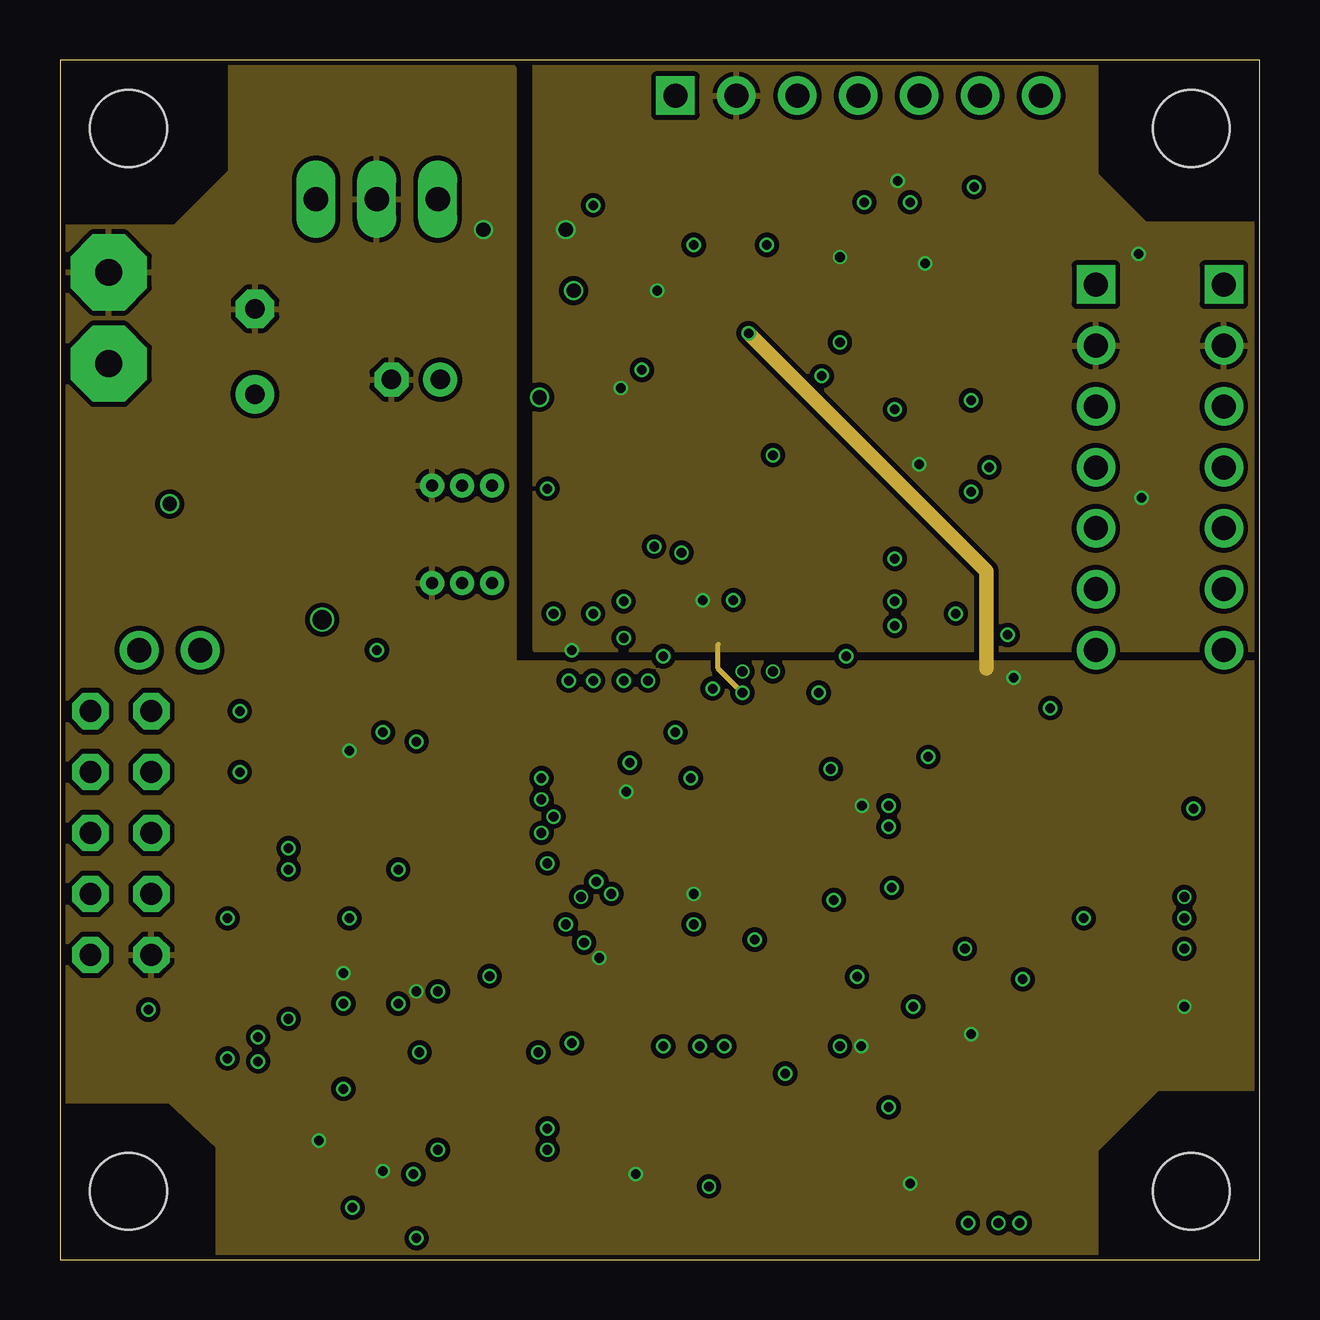
[diagram p8: board, inner layer Layer3]
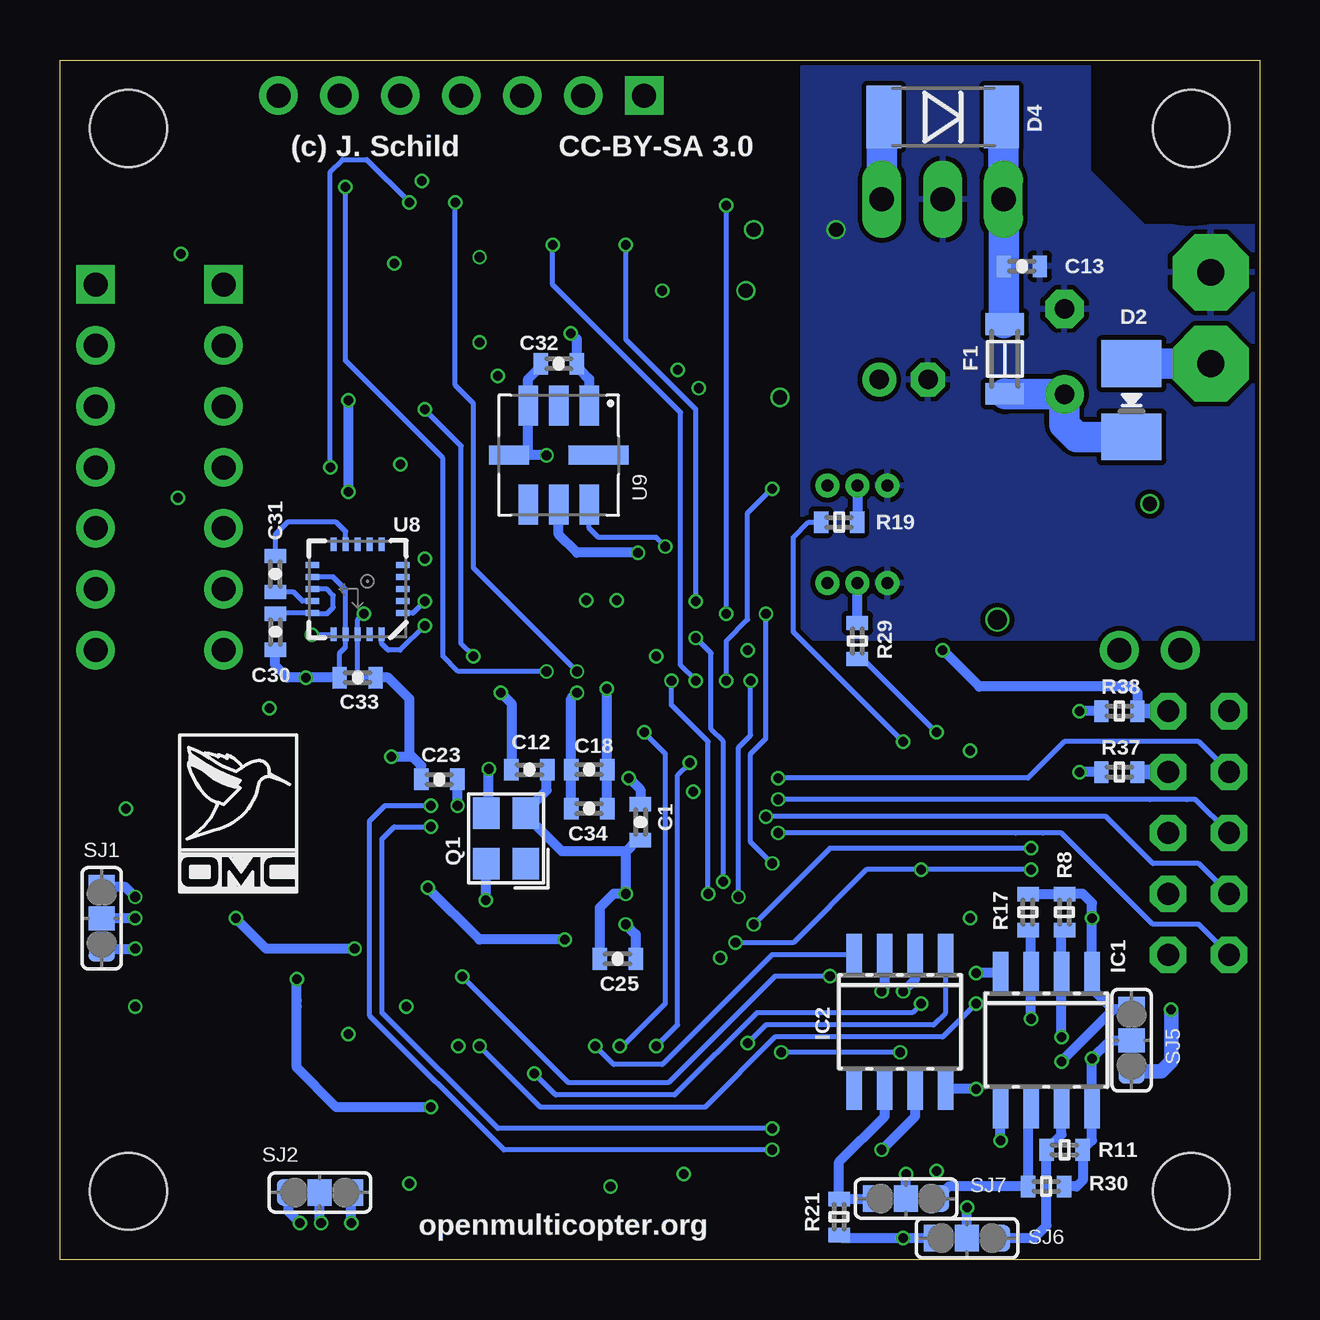
[diagram p9: board, bottom side, seen from below]

Size 50 x 50 mm. Coordinates in mm from the lower left corner, seen from the top.
Outline: 0,0 50,0 50,50 0,50 0,0
Copper layers (1*2*15*16): Top 0.035mm / dielectric 1.5mm / Layer2 0.035mm / dielectric 0.15mm / Layer3 0.035mm / dielectric 0.2mm / Bottom 0.035mm
Design rules "pcbCart-4Layer": minimum track width 8mil, minimum drill 0.4mm, track to track 8mil, track to pad 8mil, pad to pad 8mil, via to via 8mil, smd to smd 4mil, copper to edge 8mil, drill to drill 8mil, minimum pad ring 0.1mm, minimum via ring 0.1mm, stop-mask expansion 3mil, vias tented up to drill 0.4mm, thermal gap 8mil

### Footprints (pad centres in the part's own frame; a part is rotated, then mirrored left to right if it is on the bottom)
3,17/1,1 = drill 1.118 pad 3.175 octagon: 1 0,0
0603-CAP = smd 0.6 x 0.9: P$1 -0.75,0; P$2 0.75,0
E3,5-8 = drill 0.813 pad 1.6 round: + -1.778,0 | drill 0.813 pad 1.6 octagon: - 1.778,0
0805-CAP = smd 0.7 x 1.3: P$1 -0.95,0; P$2 0.95,0
3528/B = smd 1.95 x 2.5: + -1.525,0; - 1.525,0
E2-5 = drill 0.813 pad 1.27 round: + -1.016,0 | drill 0.813 pad 1.27 octagon: - 1.016,0
SOT23 = smd 1 x 1.4: 1 -0.95,-1.1; 2 0.95,-1.1; 3 0,1.1
3528/B-DIO = smd 1.95 x 2.5: A 1.525,0; C -1.525,0
MELF-MLL41 = smd 1.45 x 2.6: A 2.445,0; C -2.445,0
1206-FUSE = smd 0.9 x 1.6: P$1 -1.45,0; P$2 1.45,0
0603-LED = smd 0.6 x 0.9: A 0.75,0; C -0.75,0
SO8 = smd 0.65 x 1.75: 1 -1.905,-2.8; 2 -0.635,-2.8; 3 0.635,-2.8; 4 1.905,-2.8; 5 1.905,2.8; 6 0.635,2.8; 7 -0.635,2.8; 8 -1.905,2.8
TSSOP14 = smd 0.9 x 0.35: 1 -2.875,1.95; 2 -2.875,1.3; 3 -2.875,0.65; 4 -2.875,0; 5 -2.875,-0.65; 6 -2.875,-1.3; 7 -2.875,-1.95; 8 2.825,-1.95; 9 2.825,-1.3; 10 2.825,-0.65; 11 2.825,0; 12 2.825,0.65; 13 2.825,1.3; 14 2.825,1.95
LQFP64 = smd 1.2 x 0.3: 1 -5.75,3.75; 2 -5.75,3.25; 3 -5.75,2.75; 4 -5.75,2.25; 5 -5.75,1.75; 6 -5.75,1.25; 7 -5.75,0.75; 8 -5.75,0.25; 9 -5.75,-0.25; 10 -5.75,-0.75; 11 -5.75,-1.25; 12 -5.75,-1.75; 13 -5.75,-2.25; 14 -5.75,-2.75; 15 -5.75,-3.25; 16 -5.75,-3.75; 33 5.75,-3.75; 34 5.75,-3.25; 35 5.75,-2.75; 36 5.75,-2.25; 37 5.75,-1.75; 38 5.75,-1.25; 39 5.75,-0.75; 40 5.75,-0.25; 41 5.75,0.25; 42 5.75,0.75; 43 5.75,1.25; 44 5.75,1.75; 45 5.75,2.25; 46 5.75,2.75; 47 5.75,3.25; 48 5.75,3.75 | smd 0.3 x 1.2: 17 -3.75,-5.75; 18 -3.25,-5.75; 19 -2.75,-5.75; 20 -2.25,-5.75; 21 -1.75,-5.75; 22 -1.25,-5.75; 23 -0.75,-5.75; 24 -0.25,-5.75; 25 0.25,-5.75; 26 0.75,-5.75; 27 1.25,-5.75; 28 1.75,-5.75; 29 2.25,-5.75; 30 2.75,-5.75; 31 3.25,-5.75; 32 3.75,-5.75; 49 3.75,5.75; 50 3.25,5.75; 51 2.75,5.75; 52 2.25,5.75; 53 1.75,5.75; 54 1.25,5.75; 55 0.75,5.75; 56 0.25,5.75; 57 -0.25,5.75; 58 -0.75,5.75; 59 -1.25,5.75; 60 -1.75,5.75; 61 -2.25,5.75; 62 -2.75,5.75; 63 -3.25,5.75; 64 -3.75,5.75
0805-IND = smd 0.7 x 1.3: P$1 -0.95,0; P$2 0.95,0
1210-IND = smd 0.9 x 2.5: P$1 -1.55,0; P$2 1.55,0
3,2 = hole 3.2: 0,0
ASE_OSCILLATOR = smd 1.3 x 1.1: 1 -1.05,-0.825; 2 1.05,-0.825; 3 1.05,0.825; 4 -1.05,0.825
0603-RES = smd 0.6 x 0.9: P$1 -0.75,0; P$2 0.75,0
COPAL_CVS-01B = smd 0.7 x 1.2: 1 0,-2.95; 2 0,2.95
SJ2S = smd 1 x 1.1: 1 -1.3,0; 2 0,0; 3 1.3,0
ML10L = drill 0.914 octagon: 1 -5.08,-1.27; 2 -5.08,1.27; 3 -2.54,-1.27; 4 -2.54,1.27; 5 0,-1.27; 6 0,1.27; 7 2.54,-1.27; 8 2.54,1.27; 9 5.08,-1.27; 10 5.08,1.27
MA02-1 = drill 1.016 round: 1 -2.54,0; 2 0,0
SMD_HEADER_1.27MM_2X5 = smd 0.74 x 1.85: 1 -2.54,2.17; 2 -2.54,-2.17; 3 -1.27,2.17; 4 -1.27,-2.17; 5 0,2.17; 6 0,-2.17; 7 1.27,2.17; 8 1.27,-2.17; 9 2.54,2.17; 10 2.54,-2.17
SOT23-BEC = smd 1 x 1.4: B -0.95,-1.1; C 0,1.1; E 0.95,-1.1
MLX90609-BREAKOUT = drill 1 square: 1 7.62,0 | drill 1 round: 2 5.08,0; 3 2.54,0; 4 0,0; 5 -2.54,0; 6 -5.08,0; 7 -7.62,0
MXR9500-LCC16 = smd 3.492 x 0.635: 1 3.334,0.635 | smd 2.54 x 0.635: 2 3.81,1.905; 7 -3.81,1.905; 8 -3.81,0.635; 9 -3.81,-0.635; 10 -3.81,-1.905; 15 3.81,-1.905; 16 3.81,-0.635 | smd 0.635 x 2.54: 3 1.905,3.81; 4 0.635,3.81; 5 -0.635,3.81; 6 -1.905,3.81; 11 -1.905,-3.81; 12 -0.635,-3.81; 13 0.635,-3.81; 14 1.905,-3.81
SOT223 = smd 1.219 x 2.235: 1 -2.311,-3.099; 2 0,-3.099; 3 2.311,-3.099 | smd 3.6 x 2.2: 4 0,3.099
R-78XX = drill 1.016 long: GND 0,-1.775; IN -2.54,-1.775; OUT 2.54,-1.775
LPCC20-HMC5843 = smd 0.25 x 0.56: 1 1,1.88; 2 0.5,1.88; 3 0,1.88; 4 -0.5,1.88; 5 -1,1.88; 11 -1,-1.88; 12 -0.5,-1.88; 13 0,-1.88; 14 0.5,-1.88; 15 1,-1.88 | smd 0.56 x 0.25: 6 -1.88,1; 7 -1.88,0.5; 8 -1.88,0; 9 -1.88,-0.5; 10 -1.88,-1; 16 1.88,-1; 17 1.88,-0.5; 18 1.88,0; 19 1.88,0.5; 20 1.88,1
LCC8 = smd 1.67 x 0.8: 1 -2.065,1.27; 2 -2.065,0; 3 -2.065,-1.27; 5 2.065,-1.27; 6 2.065,0; 7 2.065,1.27 | smd 0.8 x 1.67: 4 0,-2.065 | smd 0.8 x 2.5: 8 0,1.65
GND-AGND = smd 0.6 x 0.9: AGND 0.75,0; GND -0.75,0
PB-53261-04 = smd 0.8 x 1.6: 1 -1.875,1.1; 2 -0.625,1.1; 3 0.625,1.1; 4 1.875,1.1 | smd 2.1 x 3: MNT1 -4.425,-1.8; MNT2 4.425,-1.8
PB-53047-03 = drill 0.5 round: 1 -1.25,0; 2 0,0; 3 1.25,0
PB-53261-03 = smd 0.8 x 1.6: 1 -1.25,1.1; 2 0,1.1; 3 1.25,1.1 | smd 2.1 x 3: MNT1 -3.8,-1.8; MNT2 3.8,-1.8

### Placement (x,y rotation side)
BATT+  2.03,37.34 90 top
BATT-  2.03,41.15 90 top
C1  25.81,18.24 270 bottom
C2  8.13,37.85 90 top
C3  44.96,40.13 90 top
C4  33.78,45.97 90 top
C5  40.64,38.1 0 top
C6  40.64,33.02 0 top
C7  8.64,4.57 0 top
C8  14.99,12.45 180 top
C9  19.3,24.64 90 top
C10  34.8,31.5 270 top
C11  24.89,38.61 270 top
C12  30.43,20.42 0 bottom
C13  9.91,41.4 0 bottom
C14  32.51,40.13 90 top
C15  9.65,32 270 top
C16  14.99,40.39 180 top
C17  9.65,28.96 90 top
C18  27.94,20.42 180 bottom
C19  22.86,41.4 90 top
C20  22.35,37.59 0 top
C21  12.19,31.24 270 top
C22  14.83,36.68 180 top
C23  34.19,20.02 0 bottom
C24  36.28,9.39 0 top
C25  26.75,12.53 180 bottom
C26  21.84,34.54 90 top
C27  30.99,40.13 270 top
C28  26.42,40.13 270 top
C29  8.64,6.1 180 top
C30  41.02,26.16 270 bottom
C31  41.02,28.57 90 bottom
C32  29.21,37.34 180 bottom
C33  37.59,24.26 0 bottom
C34  27.94,18.8 180 bottom
D1  21.34,45.21 270 top
D2  5.33,35.81 90 bottom
D4  13.21,47.62 180 bottom
F1  10.62,37.54 90 bottom
H0  43.44,18.79 0 top
H1  48.51,19.81 0 top
H2  48.51,21.34 0 top
H3  48.51,22.86 0 top
H4  43.43,15.75 0 top
H5  43.43,17.27 0 top
IC1  8.89,9.14 180 bottom
IC2  14.99,9.91 180 bottom
IC3  36.07,40.13 90 top
IC4  22.86,25.65 90 top
IC5  30.48,16.26 270 top
L2  19.05,37.59 0 top
L102  18.54,40.39 0 top
M1  2.85,47.15 0 top
M2  47.15,47.15 0 top
M3  47.15,2.85 0 top
M4  2.85,2.85 0 top
Q1  31.41,17.55 90 bottom
R1  46.48,36.32 270 top
R2  42.16,11.68 180 top
R3  30.73,45.97 90 top
R4  42.16,10.16 180 top
R5  26.67,7.11 90 top
R6  40.64,35.05 0 top
R7  25.15,7.11 90 top
R8  8.13,14.48 90 bottom
R9  40.64,29.97 0 top
R10  46.48,40.13 90 top
R11  8.13,4.57 0 bottom
R12  29.46,40.13 90 top
R13  27.94,40.13 90 top
R14  32.26,45.97 90 top
R15  38.1,7.11 90 top
R16  36.58,7.11 90 top
R17  9.65,14.48 90 bottom
R18  40.64,36.58 0 top
R19  17.53,30.73 0 bottom
R20  12.95,7.87 270 top
R21  17.53,1.78 270 bottom
R22  20.83,49.02 180 top
R23  20.83,47.5 0 top
R25  40.64,31.5 0 top
R26  45.97,19.81 0 top
R27  45.97,21.34 0 top
R28  45.97,22.86 0 top
R29  16.76,25.78 90 bottom
R30  8.89,3.05 0 bottom
R31  40.89,15.75 0 top
R32  12.52,23.47 0 top
R33  8.89,26.67 180 top
R34  21.84,32 90 top
R35  40.89,17.27 0 top
R36  37.59,25.15 180 top
R37  5.84,20.32 0 bottom
R38  5.84,22.86 0 bottom
R39  40.89,18.8 0 top
S1  39.75,22.99 270 top
SJ1  48.26,14.22 90 bottom
SJ2  39.17,2.79 0 bottom
SJ4  41.4,13.21 180 top
SJ5  5.33,9.14 90 bottom
SJ6  12.19,0.89 180 bottom
SJ7  14.73,2.54 180 bottom
SV1  2.54,17.78 90 top
SV2  3.3,25.4 180 top
SV3  14.22,17.78 90 top
T1  9.42,24.38 90 top
U1  43.18,33.02 90 top
U3  33.27,48.51 180 top
U4  48.51,33.02 90 top
U5  28.7,33.02 180 top
U6  4.57,30.48 90 top
U7  13.21,45.97 0 top
U8  37.59,27.94 270 bottom
U9  29.21,33.53 270 bottom
U$2  19.3,42.93 0 top
U$3  [OMC-LOGO-6MIL-SILKSCREEN]  7.62,14.73 0 top
U$4  [OMC-LOGO-6MIL-SILKSCREEN]  42.55,19.05 0 bottom
X1  25.91,3.81 0 top
X2  16.76,32.26 180 top
X3  16.76,28.19 180 top
X5  37.34,3.81 0 top
X6  46.23,12.45 90 top
X9  13.46,3.81 0 top

### Tracks (layer width: path | path; a pad name or v marks a point on that pad's centre or on a via)
ACC-X  (via drill 0.4)
  Top 0.203: IC5.25 22.61,16.01 v22.35,15.75 | IC4.9 24.16,27.78 24.38,27.56 24.51,27.56 | IC4.8 24.81,27.73 24.64,27.56 24.51,27.56 | 24.51,27.56 24.51,26.92 v23.5,25.91
  Bottom 0.203: v23.5,25.91 22.86,25.27 22.86,22.1 22.35,21.59 v22.35,15.75
ACC-Y  (via drill 0.4)
  Top 0.203: IC5.26 23.25,15.51 v22.99,15.24 | IC4.7 24.81,23.45 24.64,23.62 24.51,23.62 | IC4.6 24.16,23.45 24.33,23.62 24.51,23.62 | v24.51,24.13 24.51,23.62
  Bottom 0.203: v22.99,15.24 22.99,21.59 24.51,23.11 v24.51,24.13
ACC-Z  (via drill 0.4)
  Top 0.203: IC5.27 23.77,15.01 23.37,14.61 22.23,14.61 v21.72,15.11 | IC4.1 20.91,23.45 21.08,23.62 21.21,23.62 | 21.21,23.62 21.34,23.62 21.56,23.4 IC4.2 | v21.21,24.13 21.21,23.62
  Bottom 0.203: v21.72,15.11 21.72,21.34 21.21,21.84 v21.21,24.13
AGND  (via drill 0.4, 0.4 pad 0.6, 0.6)
  Top 0.203: IC5.12 28.73,23.34 v28.45,23.62 | C27.P$2 31.01,39.38 | C11.P$1 24.92,39.38 | 24.92,40.36 v24.89,40.39 | C26.P$2 21.86,35.31 | 23.37,37.53 C20.P$2 | v26.8,27.48 U5.3 | 21.32,25.39 v21.34,25.4 21.97,26.04 22.61,26.04 22.86,26.29 22.86,26.57 IC4.11 | IC3.11 v36.07,41.53
  Top 0.406: R18.P$2 C5.P$2 U1.2 | v32.51,41.78 C14.P$2 31.01,39.38 | C28.P$2 24.92,39.38 24.92,40.36 | 21.86,35.31 22.86,35.31 | 23.37,37.53 v23.37,36.32 22.86,35.81 22.86,35.31 | 34.66,32.38 C10.P$1 | v45.09,31.75 42.16,31.75 41.91,31.5 R25.P$2 C6.P$2 | R10.P$2 C3.P$2 v44.96,41.91 | 30.61,31.37 30.61,32.13 30.86,32.38 U5.8 34.66,32.38 | 30.61,31.37 U5.6 | 30.61,31.37 29.59,31.37 29.34,31.11 U5.5 | 34.66,32.38 35.05,32.38 v35.81,33.15 | C9.P$2 21.32,25.39 | R14.P$2 C4.P$2 34.43,46.72 34.92,46.23 v34.92,44.96 | 22.86,35.31 22.86,34.92 | 22.86,34.92 U5.15 | U5.16 23.11,33.66 22.86,33.91 22.86,34.92
  Top 0.813: U$2.AGND v21.08,42.93 22.29,42.93 C19.P$2
  Layer3 0.203: v28.45,23.62 27.43,24.64 27.43,25.65
  Bottom 0.406: C34.P$2 C18.P$2 28.69,23.38 v28.45,23.62
  pour Layer3: 19.81,49.78 43.18,49.78 43.18,45.21 45.21,43.18 49.78,43.18 49.78,25.4 19.81,25.4 19.81,49.66
AVCC  (via drill 0.6)
  Top 0.61: v21.41,40.39 22.79,40.39 C19.P$1
  Top 0.813: L102.P$2 v21.41,40.39
  Layer2 0.61: 25.65,46.28 U3.1 | U4.1 U1.1 43.18,43.05 39.88,46.35 25.73,46.35 25.65,46.28 | 25.65,46.28 25.65,44.63 v21.41,40.39
AVDD  (via drill 0.4, 0.4 pad 0.6, 0.6)
  Top 0.203: IC3.4 36.07,38.23 35.81,38.48 | C11.P$2 24.78,37.86 | v28.07,27.48 U5.4 28.07,28.32 | C9.P$1 20.18,24.77 22.48,24.77 22.86,24.38 | 22.86,24.38 IC4.4 | 22.86,24.38 23.62,25.15 v25.15,25.15 | IC5.13 28.23,22.77 v27.2,23.8
  Top 0.406: v32.51,38.23 C14.P$1 34.91,39.38 35.81,38.48 | U5.11 v31.75,36.83 | v34.8,29.21 C10.P$2 | 24.64,37.08 v24.26,37.08 | 24.64,37.08 24.89,37.34 C11.P$2 | U5.14 24.89,36.83 24.64,37.08
  Top 0.813: C20.P$1 L2.P$2 20,35.95 v19.99,35.94
  Bottom 0.406: C34.P$1 C18.P$1 27.19,23.79 v27.2,23.8
  pour Layer2: 19.81,49.78 19.81,22.48 49.78,22.48 49.78,43.18 45.21,43.18 43.18,45.21 43.18,49.78
BUZZER  (via drill 0.4)
  Top 0.203: IC5.40 v30.23,7.75 | v14.1,10.67 10.16,14.61 10.16,20.36 10.38,20.57 10.52,20.72 R32.P$2
  Bottom 0.203: v30.23,7.75 29.34,6.86 24.38,6.86 20.95,10.29 14.48,10.29 v14.1,10.67
CAN-H  (via drill 0.4)
  Top 0.406: v15.75,4.57 15.75,1.78 v14.86,0.89
  Bottom 0.203: R21.P$2 17.51,1.02
  Bottom 0.406: IC2.7 14.35,5.97 v15.75,4.57 | SJ6.3 v14.86,0.89 17.39,0.89 R21.P$2
CAN-L
  Bottom 0.203: R21.P$1 17.51,2.54
  Bottom 0.406: IC2.6 15.62,5.97 17.53,4.06 R21.P$1 | 17.51,2.54 SJ7.3
CAN-RX  (via drill 0.4)
  Top 0.203: IC5.35 27.73,8.93 v27.69,8.89
  Bottom 0.203: v27.69,8.89 26.92,8.13 24.89,8.13 20.32,12.7 IC2.4
CAN-SLP  (via drill 0.4)
  Top 0.203: IC5.33 26.7,10.54 21.84,10.54 v19.94,8.64 | R20.P$1 12.97,8.64
  Top 0.406: 12.97,8.64 v14.99,8.64
  Bottom 0.203: v14.99,8.64 v19.94,8.64
CAN-TX  (via drill 0.4)
  Top 0.203: IC5.34 27.23,9.7 27.05,9.53 21.84,9.53 v21.34,9.02
  Bottom 0.203: IC2.1 13.08,10.29 13.59,9.78 20.57,9.78 v21.34,9.02
DSL-RX
  Top 0.203: IC5.52 38.19,14.01 38.61,13.59 38.61,11.68 40.13,10.16 R4.P$2
DSL-TX  (via drill 0.4)
  Top 0.203: IC5.51 37.17,13.51 v37.72,12.95 | 42.67,13.24 SJ4.1
  Top 0.406: v42.67,14.22 42.67,13.24
  Bottom 0.406: v37.72,12.95 41.4,12.95 v42.67,14.22
GND  (via drill 0.4, 0.6)
  Top 0.203: IC5.31 22.91,13.01 v22.48,12.57 | IC5.28 25.68,14.51 v26.42,15.24 | SV3.9 SV3.7 SV3.5 SV3.3 | IC5.47 33.73,9.22 v33.4,8.89 | IC5.18 v23.6,19.51 | 46.83,10.57 v46.86,10.54 | 35.46,3.21 v35.43,3.17 | C24.P$2 37.96,9.39 v37.97,9.4 | 24.03,3.59 v24,3.56 | C29.P$1 9.39,4.96 9.4,4.95 | 12.05,21.2 v12.06,21.21 | IC5.63 35.23,19.51 35.05,19.68 34.19,19.68 v33.43,18.92
  Top 0.406: C7.P$2 C29.P$1 | X6.1 46.83,10.57 | X5.1 35.46,3.21 | X1.1 24.03,3.59 | X9.2 v13.46,3.68 | 9.4,4.95 v10.79,4.95 | C8.P$2 14.24,11.8 v14.86,11.18 | SV3.3 12.05,21.2 | v39.75,24.26 39.75,24.64 39.24,25.15 R36.P$1
  Top 0.61: T1.E 12,25.33 12.19,25.53 12.19,27.3 | 18.41,46.23 18.48,46.16 D1.1 20.08,46.32 R23.P$1
  Top 0.813: v17.65,42.93 U$2.GND
  Layer3 0.61: v28.7,38.61 38.61,28.7 38.61,24.64
  Bottom 0.203: C32.P$1 28.32,37.2 28.32,37.08 28.45,37.21 | U8.12 38.61,28.45 38.09,27.93 U8.17 38.1,25.53 38.34,25.29 C33.P$1 38.35,24.26 C33.P$1 | v11.8,11.94 v11.81,11.94 | 25.95,17.49 C1.P$2 | 30.58,18.7 Q1.2 30.58,18.52 | 29.72,20.38 C12.P$2 | 33.44,18.93 v33.43,18.92
  Bottom 0.406: U9.1 27.94,36.7 28.32,37.08 | v10.79,4.95 IC1.5 | IC2.2 14.35,11.68 v14.86,11.18 | IC1.4 v11.8,11.94 | C25.P$2 27.5,14.66 26.92,15.24 v26.42,15.24 26.42,17.02 | 26.42,17.02 25.95,17.49 | 30.58,18.7 29.72,19.56 29.72,20.38 | 30.58,18.52 29.08,17.02 26.42,17.02 | C30.P$2 41.02,24.77 40.51,24.26 v39.75,24.26 38.35,24.26 | C32.P$1 28.46,38.37 v28.7,38.61 | C23.P$2 33.44,18.93
  pour Layer3: 18.8,49.78 18.92,49.66 18.92,24.89 49.78,24.89 49.78,7.11 45.72,7.11 43.18,4.57 43.18,0.13 6.6,0.13 6.6,4.7 4.57,6.6 0.13,6.6 0.13,43.05 4.83,43.05 7.11,45.34 7.11,49.78
  pour Bottom: 0.13,43.05 4.83,43.05 7.11,45.34 7.11,49.78 19.05,49.78 19.05,25.91 0.13,25.91
  pour Top: 7.11,49.78 7.11,45.34 4.83,43.05 0.13,43.05 0.13,25.91 19.05,25.91 19.05,49.78
GPS-RX  (via drill 0.4)
  Top 0.203: R7.P$2 v25.15,8.89 | IC5.17 24.06,20.01 23.75,20.32 v23.75,20.7
  Bottom 0.203: v23.75,20.7 24.26,20.19 24.26,9.78 v25.15,8.89
GPS-TX  (via drill 0.4)
  Top 0.203: v25.65,21.97 26.7,21.97 IC5.16 | R5.P$2 v26.67,8.89
  Bottom 0.203: v26.67,8.89 26.54,8.89 24.77,10.67 24.77,21.08 v25.65,21.97
GYRO-TEMP  (via drill 0.4, 0.4 pad 0.6)
  Top 0.203: IC5.11 29.23,23.73 v28.45,24.51 | IC3.13 34.77,43.84 34.54,44.07 34.16,44.07 | v33.53,44.07 34.16,44.07 | IC3.14 34.12,44.02 34.16,44.07
  Bottom 0.203: v28.45,24.51 32.77,28.83 32.77,35.69 33.53,36.45 v33.53,44.07
GYRO-X  (via drill 0.4)
  Top 0.203: 34.07,37.21 IC3.1 34.12,36.62 34.42,36.32 34.8,36.32 | v34.8,35.43 34.8,36.32 | 34.8,36.32 34.8,37.23 IC3.2 | IC5.8 30.73,23.75 32.13,25.15 v32.77,25.15
  Bottom 0.203: v34.8,35.43 33.27,33.91 33.27,25.65 v32.77,25.15
GYRO-Y  (via drill 0.4)
  Top 0.203: IC3.6 37.37,36.42 37.66,36.13 | v37.97,35.81 37.66,36.13 | IC3.7 38.02,36.49 37.66,36.13 | v37.97,32 37.97,28.45 35.31,25.78 32,25.78 30.23,24.01 IC5.9
  Bottom 0.406: v37.97,32 v37.97,35.81
GYRO-Z  (via drill 0.4, 0.4 pad 0.6)
  Top 0.203: IC5.10 29.73,24.5 v29.72,24.51 | IC3.9 37.37,43.97 37.59,44.2 | v38.1,44.7 37.59,44.2 | IC3.8 38.02,43.77 37.59,44.2
  Bottom 0.203: v38.1,44.7 38.1,37.47 34.04,33.4 34.04,25.15 33.4,24.51 v29.72,24.51
H4
  Top 0.406: R31.P$2 H4.C
I2C1-SCL  (via drill 0.4)
  Top 0.203: IC5.61 35.02,18.51 v34.54,18.03 | v20.32,5.46 15.75,10.03 v9.53,10.03
  Bottom 0.203: 9.53,13.6 R17.P$1 | v34.54,18.03 36.07,18.03 36.58,17.53 36.58,10.29 31.75,5.46 v20.32,5.46
  Bottom 0.406: v9.53,10.03 IC1.3 9.53,13.6
I2C1-SDA  (via drill 0.4)
  Top 0.203: IC5.62 34.63,19.01 v34.54,18.92 | v8.26,9.27 15.62,9.27 v20.32,4.57
  Bottom 0.203: 8.26,13.6 R8.P$1 | v34.54,18.92 36.45,18.92 37.08,18.29 37.08,10.16 31.5,4.57 v20.32,4.57
  Bottom 0.406: 8.26,13.6 IC1.2 v8.26,9.27
I2C2-SCL  (via drill 0.4)
  Top 0.203: IC5.29 21.12,14.01 v21.08,13.97 | v34.8,27.43 34.24,26.87 26.47,26.87 25.91,27.43 v25.91,29.46 25.91,30.1 25.65,30.35 19.94,30.35 19.05,29.46 19.05,27.69 16.76,25.4 v13.21,25.4
  Top 0.406: v9.53,17.14 SV1.9
  Bottom 0.203: v21.08,13.97 17.91,17.14 v9.53,17.14 | 5.08,22.87 R38.P$2 | U8.1 35.29,26.94 v34.8,27.43
  Bottom 0.406: U9.6 29.21,30.23 28.45,29.46 v25.91,29.46 | 5.08,22.87 5.08,23.62 5.33,23.88 11.68,23.88 v13.21,25.4
  Bottom 0.61: SV1.9 R38.P$2
I2C2-SDA  (via drill 0.4)
  Top 0.203: IC5.30 22.14,13.51 v21.84,13.21 | v14.1,16.26 14.1,21.97 19.56,27.43 19.56,28.7 20.57,29.72 v24.77,29.72 25.4,29.08 25.4,27.3 26.29,26.42 v34.8,26.42
  Top 0.406: v9.53,16.26 7.87,16.26 SV1.7
  Bottom 0.203: U9.7 27.94,30.48 27.56,30.1 25.15,30.1 v24.77,29.72 | U8.20 36.59,25.67 36.32,25.4 35.81,25.4 v34.8,26.42 | v9.53,16.26 v14.1,16.26 16.38,16.26 19.43,13.21 v21.84,13.21
  Bottom 0.61: SV1.7 R37.P$2
LED-0
  Top 0.203: R39.P$1 40.14,18.68 39.5,18.03 39.5,17.14 38.35,16 IC5.56
LED-1
  Top 0.203: IC5.57 38.22,16.51 38.99,17.27 38.99,19.3 39.5,19.81 R26.P$1
LED-2
  Top 0.203: R27.P$1 40.39,21.34 38.48,19.43 38.48,17.53 37.96,17.01 IC5.58
LED-3
  Top 0.203: R28.P$1 44.45,22.86 43.56,21.97 40.39,21.97 37.85,19.43 37.85,17.65 37.7,17.51 IC5.59
LED-4
  Top 0.203: IC5.53 38.9,14.51 R31.P$1
LED-5
  Top 0.203: R35.P$1 40.14,17.16 37.99,15.01 IC5.54
N$1  (via drill 0.4)
  Top 0.203: 39.12,4.81 X5.4
  Top 0.406: v39.12,1.52 39.12,4.81
  Bottom 0.203: v39.12,1.52 39.17,1.57
  Bottom 0.406: 39.17,1.57 SJ2.2
N$2
  Top 0.203: R4.P$1 43.43,10.16 43.81,10.54 43.81,11.43 44.2,11.81 45.12,11.81 X6.2
N$3  (via drill 0.4)
  Top 0.203: IC5.5 32.23,20.55 v32.13,20.45
  Bottom 0.203: Q1.3 32.13,18.7
  Bottom 0.406: 32.13,18.7 v32.13,20.45
N$4
  Top 0.203: 25.28,6.22 R7.P$1
  Top 0.406: X1.2 25.28,6.22
N$5  (via drill 0.4)
  Top 0.203: v11.81,7.11 11.82,7.12
  Top 0.406: 11.82,7.12 R20.P$2
  Bottom 0.203: IC2.8
  Bottom 0.406: v11.81,7.11 IC2.8
N$6
  Top 0.203: X6.3 44.06,13.07 43.69,12.7 43.69,11.94 43.43,11.68 R2.P$1
N$7
  Top 0.813: R22.P$2 12.32,49.02 10.67,47.37 U7.IN
  Bottom 0.813: F1.P$2 10.66,39.03
  Bottom 1.27: 10.66,39.03 C13.P$1 10.66,44.19 U7.IN 10.67,47.53 D4.C
N$8
  Bottom 1.27: D2.A BATT+.1
N$9
  Top 0.203: 36.71,6.22 R16.P$1
  Top 0.406: X5.2 36.71,6.22
N$10
  Top 0.203: 26.53,6.22 R5.P$1
  Top 0.406: X1.3 26.53,6.22
N$11
  Top 0.203: 36.7,37.27 IC3.5 36.72,38.34 36.7,38.35 | R14.P$1 32.26,43.05 36.7,38.61 36.7,38.35 | 36.7,38.35 36.7,38.23
  Top 0.406: R3.P$1 R14.P$1 C4.P$1
N$12
  Top 0.203: R1.P$1 46.47,37.08 45.34,37.08 44.96,36.7 44.96,35.05 44.07,34.16 37.08,34.16 35.42,35.83 IC3.3
  Top 0.406: R1.P$1 R10.P$1 C3.P$1
N$13
  Top 0.406: U1.3 41.9,35.56 R6.P$2
N$14  (via drill 0.4)
  Top 0.203: v12.19,2.16 12.21,2.18
  Top 0.406: 12.21,2.18 X9.1
  Bottom 0.406: SJ6.2 v12.19,2.16
N$15  (via drill 0.4)
  Top 0.203: 14.73,4.89 X9.3
  Top 0.406: v14.73,3.56 14.73,4.89
  Bottom 0.406: SJ7.2 v14.73,3.56
N$16
  Top 0.406: U1.5 41.9,30.48 R9.P$2
N$17
  Top 0.203: C5.P$1 39.88,38.11 39.88,39.12 37.47,41.53 36.72,42.28 IC3.10
  Top 0.406: C5.P$1 R18.P$1 R6.P$1
N$18  (via drill 0.4)
  Top 0.203: 35.43,42.94 IC3.12 35.43,42.97 v35.43,44.07
  Top 0.406: R9.P$1 R25.P$1 C6.P$1 v38.73,33.02
  Bottom 0.203: v35.43,44.07 37.21,45.85 38.23,45.85 38.73,45.34 v38.73,33.02
N$19
  Top 0.203: R1.P$2 46.49,35.56
  Top 0.406: 46.49,35.56 U4.3
N$20
  Top 0.203: 37.96,6.22 R15.P$1
  Top 0.406: X5.3 37.96,6.22
N$21
  Bottom 1.016: D2.C
  Bottom 1.27: F1.P$1 10.59,36.07 C2.+ 8.13,34.8 7.62,34.29 D2.C
N$22
  Top 0.406: R3.P$2 U3.3
N$23  (via drill 0.4)
  Top 0.203: X6.4 45.23,14.22
  Top 0.406: 45.23,14.22 v46.86,14.22
  Bottom 0.406: v46.86,14.22 SJ1.2
N$24
  Top 0.203: R34.P$1 21.98,31.11
  Top 0.406: 21.98,31.11 U5.2
N$25
  Top 0.406: R33.P$2 7.11,26.67 SV2.1
N$26
  Top 0.203: U5.12 29.46,36.96
  Top 0.406: 29.46,36.96 R12.P$1
N$27
  Top 0.203: 41.41,13.2 SJ4.2
  Top 0.406: R2.P$2 41.41,13.2
N$28
  Top 0.203: IC5.60 37.18,18.01 37.34,18.16 37.34,21.72 36.83,22.23 36.83,22.96 S1.1 | 36.8,25.11 R36.P$2
  Top 0.406: S1.1 36.8,25.11
N$29
  Top 0.406: SV2.2 4.7,24 6.48,24 6.86,24.38 T1.C
N$30  (via drill 0.4)
  Top 0.203: v22.23,26.92 22.21,26.94 IC4.12 | 22.23,45.13 22.35,45.13 D1.3
  Top 0.406: R22.P$1 R23.P$2 22.18,47.5 22.44,47.24 D1.3 | v22.23,43.94 22.23,45.13
  Bottom 0.203: v22.23,26.92 v22.23,43.94
N$31
  Top 0.406: T1.B 11.36,23.43 R32.P$1
N$33
  Top 0.406: R35.P$2 H5.C
N$34
  Bottom 0.203: U8.9 38.09,30.34 38.48,30.73 40.51,30.73 41.02,30.23 C31.P$2
N$35
  Top 0.203: 42.68,18.8 H0.C
  Top 0.406: R39.P$2 42.68,18.8
N$36
  Top 0.203: U5.13 27.94,36.96
  Top 0.406: 27.94,36.96 R13.P$1
N$37
  Bottom 0.406: X2.2 16.76,30.75 R19.P$2
N$38  (via drill 0.4)
  Top 0.406: C7.P$1 7.87,4.57 7.87,4.7 6.99,5.59 v6.99,8.38
  Bottom 0.406: SJ5.2 6.22,9.14 v6.99,8.38 IC1.8 6.99,4.96 R11.P$2 7.37,4.56 7.37,3.3 7.62,3.05 R30.P$2
N$39
  Bottom 0.203: U8.13 38.86,27.94 38.61,27.69 38.61,27.18 38.86,26.92 39.46,26.92 U8.15 40.99,26.94 C30.P$1
N$40  (via drill 0.4)
  Top 0.203: IC4.3 22.21,24.11 v22.23,24.13
  Top 0.406: C26.P$1 R34.P$2 20.94,32.75 v20.32,32.13
  Bottom 0.203: v22.23,24.13 22.23,25.78 21.34,26.67 21.34,31.11 v20.32,32.13
N$41
  Top 0.406: H1.C R26.P$2
N$42  (via drill 0.4)
  Top 0.203: v23.5,24.13 23.5,22.79 IC4.5
  Top 0.406: C27.P$1 R12.P$2 v29.46,42.29
  Bottom 0.203: v29.46,42.29 29.46,40.64 24.13,35.31 24.13,24.77 v23.5,24.13
N$43  (via drill 0.4)
  Top 0.203: v23.5,27.43 23.5,28.46 IC4.10
  Top 0.406: R13.P$2 C28.P$1 v26.42,42.29
  Bottom 0.203: v26.42,42.29 26.42,38.35 23.5,35.43 v23.5,27.43
N$44
  Top 0.406: H2.C R27.P$2
N$45
  Top 0.406: H3.C R28.P$2
N$46
  Bottom 0.406: R29.P$2 X3.2
N$48
  Bottom 0.203: U8.14 39.89,27.44 40.26,27.81 C31.P$1
PC-RX
  Top 0.203: R16.P$2 36.56,7.87 32.51,7.87 31.73,8.66 IC5.43
PC-TX
  Top 0.203: R15.P$2 38.1,7.37 37.85,7.11 33.4,7.11 33.15,7.11 32.64,7.11 31.23,8.52 IC5.42
PPM  (via drill 0.4)
  Top 0.203: v40.13,11.68 40.1,11.71 | IC5.41 30.73,8.13 32.51,6.35 v34.54,6.35
  Top 0.406: 40.1,11.71 SJ4.3
  Bottom 0.406: v40.13,11.68 40.13,10.79 40.13,10.54 40.13,8 38.48,6.35 v34.54,6.35
RST  (via drill 0.4)
  Top 0.203: SV3.10 17.02,20.32 18.03,21.34 24.89,21.34 25.53,20.7 30.99,20.7 31.24,20.95 31.24,21.99 IC5.7 31.23,23.23 v31.62,23.62
  Bottom 0.406: C12.P$1 31.18,23.18 v31.62,23.62
SCL
  Bottom 0.203: 13.43,2.57 SJ7.1 | 9.64,6.23 IC1.6
  Bottom 0.406: 13.43,2.57 12.95,3.05 R30.P$1 9.64,6.23
SDA
  Bottom 0.203: R11.P$1 8.88,4.58
  Bottom 0.406: 8.88,4.58 8.26,5.21 IC1.7 | R11.P$1 8.88,1.41 9.4,0.89 SJ6.1
SERVO-1  (via drill 0.4)
  Top 0.203: v14.86,21.59 14.86,14.99 15.49,14.35 16.38,14.35 17.02,13.72 17.02,10.67 20.57,7.11 27.94,7.11 28.73,7.9 IC5.37
  Bottom 0.203: R19.P$1 18.8,30.73 19.43,30.1 19.43,26.16 17.78,24.51 14.99,21.72 v14.86,21.59
SERVO-2  (via drill 0.4)
  Top 0.203: v13.46,21.97 13.46,15.11 14.73,13.84 16,13.84 16.51,13.34 16.51,10.16 24.51,2.16 27.3,2.16 29.23,4.08 IC5.38
  Bottom 0.203: R29.P$1 16.52,25.03 v13.46,21.97
SPI1-CS1  (via drill 0.4)
  Top 0.203: IC5.20 23.28,18.51 21.72,20.07 v20.07,20.07
  Bottom 0.203: SV1.8 2.54,21.59 8.13,21.59 9.65,20.07 v20.07,20.07
SPI1-CS2  (via drill 0.4)
  Top 0.203: IC5.44 32.23,9.17 v32.51,8.89
  Top 0.406: SV1.10 2.54,21.59 2.54,11.94 3.17,11.3 11.18,11.3 v11.81,10.67
  Bottom 0.203: v32.51,8.89 29.97,6.35 23.11,6.35 20.19,9.27 13.21,9.27 v11.81,10.67
SPI1-MISO  (via drill 0.4)
  Top 0.203: IC5.22 21.53,17.51 v20.57,18.47
  Bottom 0.203: SV1.4 2.54,16.51 4.45,16.51 6.4,18.47 v20.57,18.47
SPI1-MOSI  (via drill 0.4)
  Top 0.203: IC5.23 20.84,17.01 v20.07,17.78
  Bottom 0.203: SV1.2 2.54,13.97 4.45,13.97 8.26,17.78 9.02,17.78 10.16,17.78 v20.07,17.78
SPI1-SCK  (via drill 0.4)
  Top 0.203: IC5.21 22.76,18.01 21.59,19.18 v20.07,19.18
  Bottom 0.203: SV1.6 2.67,19.18 3.05,19.18 4.57,19.18 v20.07,19.18
TCK
  Top 0.203: SV3.4 18.03,16.51 18.41,16.13 18.41,14.1 21.46,11.05 25.91,11.05 27.36,12.51 IC5.49
TDI
  Top 0.203: SV3.8 18.67,19.05 19.43,18.29 19.43,14.35 21.84,11.94 25.53,11.94 27.69,14.1 29.59,14.1 30.68,13.01 IC5.50
TDO  (via drill 0.4)
  Top 0.203: SV3.6 18.54,17.78 18.92,17.4 18.92,14.22 21.67,11.48 25.7,11.48 27.56,13.34 v28.96,13.34 | IC5.55 34.68,15.51 v34.67,15.49
  Bottom 0.406: v34.67,15.49 32.51,13.34 v28.96,13.34
TMS  (via drill 0.4)
  Top 0.203: IC5.46 v33.23,11.78 v33.22,11.79 | SV3.2 17.65,15.24 17.91,14.99 v17.91,11.81
  Bottom 0.203: v17.91,11.81 20.19,11.81 24.64,7.37 28.8,7.37 v33.22,11.79
V-BAT  (via drill 0.4)
  Top 0.203: IC5.24 v20.32,16.51 | 20.91,27.56 IC4.14 | IC4.13 21.56,27.78 21.34,27.56 20.91,27.56 | 20.91,27.56 20.91,27.26 v20.57,26.92
  Bottom 0.203: v20.32,16.51 21.21,17.4 21.21,21.08 20.57,21.72 v20.57,26.92
VCC  (via drill 0.4, 0.8)
  Top 0.61: 9.65,26.67 R33.P$1 | 7.67,28.21 U6.1
  Top 0.813: C16.P$1 L102.P$1 | C22.+ 15.74,36.79
  Top 1.016: 7.67,28.21 C17.P$1 9.65,26.67 v10.92,26.67
  Top 1.27: C16.P$1 U7.OUT | 15.74,36.79 C16.P$1
  Layer2 0.61: C22.+ 15.85,35.59 18.03,33.4 18.03,32.28 | X3.1 X2.1 | X3.1 18.01,27.29 | 18.03,26.67 v10.92,26.67 10.92,22.35 SV1.3 5.46,13.59 5.46,11.43 4.45,10.41 v3.68,10.41 | 38.99,15.11 v46.86,15.11 | 38.99,15.11 37.59,16.51 24.38,16.51 22.1,18.8 22.1,19.94 18.03,24 18.03,26.67 | v37.85,1.52 38.99,2.67 38.99,15.11 | 18.03,26.67 18.03,28.17 X3.1
  Layer2 0.813: X2.1 18.03,32.28
  Bottom 0.203: v37.85,1.52 37.87,1.54
  Bottom 0.406: SJ1.3 47.27,15.52 v46.86,15.11 | 37.87,1.54 SJ2.3
  Bottom 0.61: SJ5.1 4.09,7.84 3.68,8.26 v3.68,10.41
  Bottom 1.016: 15.75,47.53 D4.A
  Bottom 1.27: U7.OUT 15.75,47.53
VDD  (via drill 0.4, 0.6)
  Top 0.203: IC5.32 25.46,12.51 26.42,13.46 v26.42,13.97 | H5.A | v26.29,20.07 26.29,19.56 25.74,19.01 IC5.19 | IC5.64 36.23,20.92 v36.2,20.95 35.14,22.01 IC5.1 | H0.A | IC5.48 34.23,9.71 34.54,9.4 C24.P$1 35.56,9.42 | C8.P$1 | 12.06,15.23 SV3.1
  Top 0.406: H5.A H0.A | H5.A H4.A | v41.27,22.99 S1.2 | H3.A H2.A H1.A 49.26,19.04 49.02,18.8 v47.24,18.8 H0.A | C29.P$2 7.89,7.89 v8.26,8.26 | C8.P$1 v15.75,11.18 | 35.56,9.42 v35.56,10.54 | v12.06,14.22 12.06,15.23 | v27.05,3.05 27.81,3.81 27.81,4.88 X1.4
  Top 0.813: U6.3 7.7,32.77 5.84,32.77 v4.57,31.5 | C15.P$1 9.41,32.75 9.4,32.77 | C21.+ 14.1,34.67 16.64,34.67 18.1,36.13 L2.P$1
  Top 1.016: 7.7,32.77 9.4,32.77 C21.+
  Layer2 0.203: v37.34,26.92 37.34,26.95
  Layer2 0.61: 38.79,28.4 33.66,33.53 v29.72,33.53 | 38.79,28.4 39.5,27.69 v39.5,26.04 41.27,24.26 v41.27,22.99 | 37.34,26.95 38.79,28.4
  Bottom 0.203: 8.12,15.24 R8.P$2 | 6.99,11.3 IC1.1 | 29.96,37.22 C32.P$2 | U9.4 30.99,33.53 | C33.P$2 37.34,24.26 37.59,24.51 U8.18 37.59,26.67 v37.34,26.92 | U8.16 39.47,26.06 v39.5,26.04 | v46.86,12.95 46.89,12.92 | v32.26,14.99 32.23,15.01 | 6.13,10.38 6.13,10.44
  Bottom 0.406: R8.P$2 R17.P$2 | 8.12,15.24 7.37,15.24 6.99,14.86 v6.99,14.22 IC1.1 | 6.99,11.3 6.13,10.44 SJ5.3 | 29.96,37.22 30.48,36.7 U9.3 30.48,33.53 | 46.89,12.92 SJ1.1 | SJ2.1 40.47,1.99 v40.01,1.52 | C25.P$1 26,13.56 v26.42,13.97 | 32.23,15.01 Q1.4 | C23.P$1 34.94,20.59 35.31,20.95 35.43,20.95 | 35.43,20.95 v36.2,20.95 | R38.P$1 v7.49,22.86 | R37.P$1 v7.49,20.32 | v8.26,8.26 6.13,10.38 | IC2.3 15.62,11.3 v15.75,11.18 | v29.72,33.53 30.48,33.53 | 30.48,33.53 U9.4 | C33.P$2 36.32,24.26 35.43,23.37 35.43,20.95 | C1.P$1 25.81,19.58 v26.29,20.07
  pour Layer2: 19.05,49.78 7.11,49.78 7.11,45.34 4.83,43.05 0.13,43.05 0.13,6.6 4.57,6.6 6.6,4.7 6.6,0.13 43.18,0.13 43.18,4.57 45.72,7.11 49.78,7.11 49.78,21.97 19.05,21.97

### Text on the board
tPlace: Y | Z | X | CC-BY-SA 3.0 | V0.1 | DSL | BLDC | GPS | PC | (c) J. Schild
bPlace: CC-BY-SA 3.0 | (c) J. Schild | openmulticopter.org